# Altium project LPCB234__RLOOP__RM4_POWER_NODE.PrjPCB
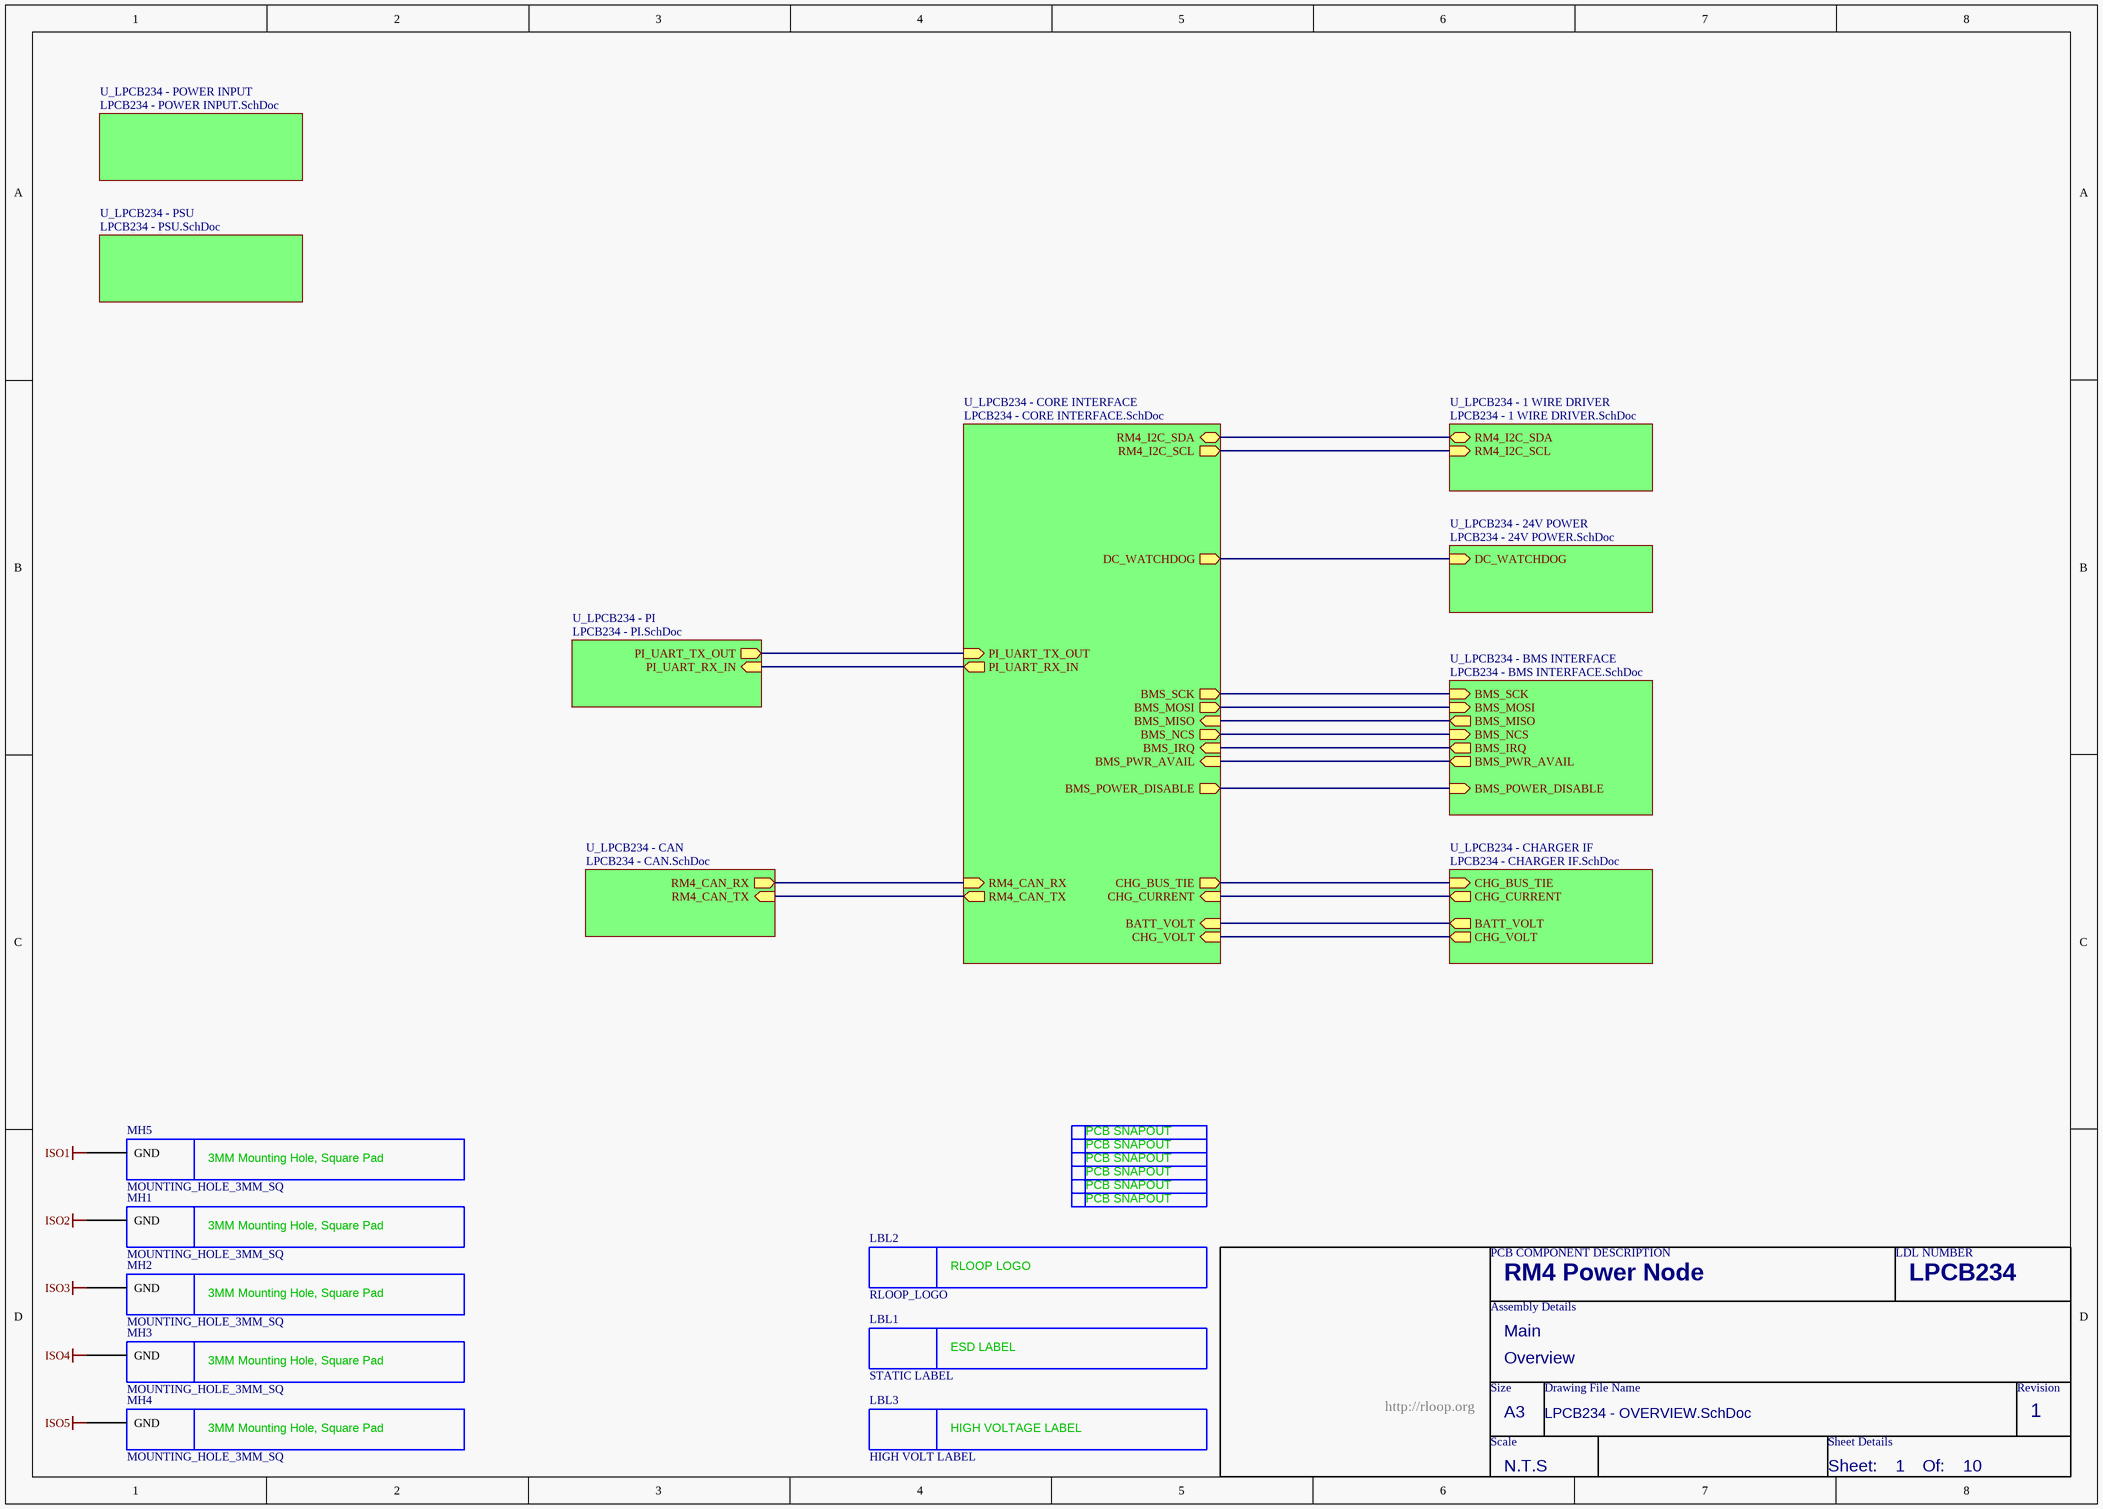
[diagram p0: LPCB234 - OVERVIEW.SchDoc]
10 sheets, 135 parts. Net scope: hierarchical (ports join the sheet entries above them; power ports are global).
Board files: LPCB234R0.PcbDoc, LPCB234R0__ASCII.PcbDoc
Sheets:
  LPCB234 - OVERVIEW.SchDoc
    U_LPCB234 - CORE INTERFACE = LPCB234 - CORE INTERFACE.SchDoc
    U_LPCB234 - 1 WIRE DRIVER = LPCB234 - 1 WIRE DRIVER.SchDoc
    U_LPCB234 - 24V POWER = LPCB234 - 24V POWER.SchDoc
    U_LPCB234 - BMS INTERFACE = LPCB234 - BMS INTERFACE.SchDoc
    U_LPCB234 - CHARGER IF = LPCB234 - CHARGER IF.SchDoc
    U_LPCB234 - POWER INPUT = LPCB234 - POWER INPUT.SchDoc
    U_LPCB234 - PSU = LPCB234 - PSU.SchDoc
    U_LPCB234 - CAN = LPCB234 - CAN.SchDoc
    U_LPCB234 - PI = LPCB234 - PI.SchDoc

## Sheet LPCB234 - OVERVIEW.SchDoc
size A3; Address1: Factory 10; Address2: 9-13 Dingley Avenue, Dandeong, VICTORIA 3175, AUSTRALIA; DocumentNumber: 1; Revision: 1; SheetNumber: 1; SheetTotal: 10; Lockie__PCB_SUB_ASSEMBLY: Overview; Lockie__PCB_ASSEMBLY: Main; Lockie__LDL: LPCB234; Lockie__PCB_DESCRIPTION: RM4 Power Node

### Parts
LBL1  STATIC LABEL  [STATIC_LABEL]  (no BOM)
LBL2  RLOOP_LOGO  [RLOOP_LOGO]  (no BOM)
LBL3  HIGH VOLT LABEL  [HIGH VOLT LABEL]  (no BOM)
MH1  MOUNTING_HOLE_3MM_SQ  [MOUNTING_HOLE_3MM_SQ]  (no BOM)
MH2  MOUNTING_HOLE_3MM_SQ  [MOUNTING_HOLE_3MM_SQ]  (no BOM)
MH3  MOUNTING_HOLE_3MM_SQ  [MOUNTING_HOLE_3MM_SQ]  (no BOM)
MH4  MOUNTING_HOLE_3MM_SQ  [MOUNTING_HOLE_3MM_SQ]  (no BOM)
MH5  MOUNTING_HOLE_3MM_SQ  [MOUNTING_HOLE_3MM_SQ]  (no BOM)
SN1  PCB_SNAPOUT  [SNAPOUT_NEW]  (value not drawn)  (no BOM)
SN2  PCB_SNAPOUT  [SNAPOUT_NEW]  (value not drawn)  (no BOM)
SN3  PCB_SNAPOUT  [SNAPOUT_NEW]  (value not drawn)  (no BOM)
SN4  PCB_SNAPOUT  [SNAPOUT_NEW]  (value not drawn)  (no BOM)
SN5  PCB_SNAPOUT  [SNAPOUT_NEW]  (value not drawn)  (no BOM)
SN6  PCB_SNAPOUT  [SNAPOUT_NEW]  (value not drawn)  (no BOM)

### Sub-sheets
U_LPCB234 - 1 WIRE DRIVER = LPCB234 - 1 WIRE DRIVER.SchDoc: RM4_I2C_SDA (bidir), RM4_I2C_SCL (in)
U_LPCB234 - 24V POWER = LPCB234 - 24V POWER.SchDoc: DC_WATCHDOG (in)
U_LPCB234 - BMS INTERFACE = LPCB234 - BMS INTERFACE.SchDoc: BMS_MOSI (in), BMS_SCK (in), BMS_MISO (out), BMS_PWR_AVAIL (out), BMS_NCS (in), BMS_IRQ (out), BMS_POWER_DISABLE (in)
U_LPCB234 - CAN = LPCB234 - CAN.SchDoc: RM4_CAN_TX (in), RM4_CAN_RX (out)
U_LPCB234 - CHARGER IF = LPCB234 - CHARGER IF.SchDoc: CHG_BUS_TIE (in), CHG_CURRENT (out), BATT_VOLT (out), CHG_VOLT (out)
U_LPCB234 - CORE INTERFACE = LPCB234 - CORE INTERFACE.SchDoc: BMS_MOSI (out), BMS_SCK (out), BMS_MISO (in), BMS_PWR_AVAIL (in), BMS_NCS (out), BMS_IRQ (in), DC_WATCHDOG (out), CHG_CURRENT (in), RM4_I2C_SDA (bidir), RM4_I2C_SCL (out), BMS_POWER_DISABLE (out), CHG_BUS_TIE (out), RM4_CAN_TX (out), RM4_CAN_RX (in), PI_UART_TX_OUT (in), PI_UART_RX_IN (out), BATT_VOLT (in), CHG_VOLT (in)
U_LPCB234 - PI = LPCB234 - PI.SchDoc: PI_UART_RX_IN (in), PI_UART_TX_OUT (out)
U_LPCB234 - POWER INPUT = LPCB234 - POWER INPUT.SchDoc: no entries
U_LPCB234 - PSU = LPCB234 - PSU.SchDoc: no entries

### Nets
ISO1: MH5.MOUNT(GND)
ISO2: MH1.MOUNT(GND)
ISO3: MH2.MOUNT(GND)
ISO4: MH3.MOUNT(GND)
ISO5: MH4.MOUNT(GND)
BMS_IRQ: sheet U_LPCB234 - CORE INTERFACE/BMS_IRQ, sheet U_LPCB234 - BMS INTERFACE/BMS_IRQ
BMS_MISO: sheet U_LPCB234 - CORE INTERFACE/BMS_MISO, sheet U_LPCB234 - BMS INTERFACE/BMS_MISO
BMS_MOSI: sheet U_LPCB234 - CORE INTERFACE/BMS_MOSI, sheet U_LPCB234 - BMS INTERFACE/BMS_MOSI
BMS_NCS: sheet U_LPCB234 - CORE INTERFACE/BMS_NCS, sheet U_LPCB234 - BMS INTERFACE/BMS_NCS
BMS_PWR_AVAIL: sheet U_LPCB234 - CORE INTERFACE/BMS_PWR_AVAIL, sheet U_LPCB234 - BMS INTERFACE/BMS_PWR_AVAIL
BMS_SCK: sheet U_LPCB234 - CORE INTERFACE/BMS_SCK, sheet U_LPCB234 - BMS INTERFACE/BMS_SCK
CHG_BUS_TIE: sheet U_LPCB234 - CORE INTERFACE/CHG_BUS_TIE, sheet U_LPCB234 - CHARGER IF/CHG_BUS_TIE
CHG_CURRENT: sheet U_LPCB234 - CORE INTERFACE/CHG_CURRENT, sheet U_LPCB234 - CHARGER IF/CHG_CURRENT
PI_UART_RX_IN: sheet U_LPCB234 - CORE INTERFACE/PI_UART_RX_IN, sheet U_LPCB234 - PI/PI_UART_RX_IN
PI_UART_TX_OUT: sheet U_LPCB234 - CORE INTERFACE/PI_UART_TX_OUT, sheet U_LPCB234 - PI/PI_UART_TX_OUT
RM4_CAN_RX: sheet U_LPCB234 - CORE INTERFACE/RM4_CAN_RX, sheet U_LPCB234 - CAN/RM4_CAN_RX
RM4_CAN_TX: sheet U_LPCB234 - CORE INTERFACE/RM4_CAN_TX, sheet U_LPCB234 - CAN/RM4_CAN_TX
RM4_I2C_SCL: sheet U_LPCB234 - CORE INTERFACE/RM4_I2C_SCL, sheet U_LPCB234 - 1 WIRE DRIVER/RM4_I2C_SCL
RM4_I2C_SDA: sheet U_LPCB234 - CORE INTERFACE/RM4_I2C_SDA, sheet U_LPCB234 - 1 WIRE DRIVER/RM4_I2C_SDA
NetCN1_2: sheet U_LPCB234 - CORE INTERFACE/DC_WATCHDOG, sheet U_LPCB234 - 24V POWER/DC_WATCHDOG
NetCN2_13: sheet U_LPCB234 - CORE INTERFACE/BMS_POWER_DISABLE, sheet U_LPCB234 - BMS INTERFACE/BMS_POWER_DISABLE
NetCN8_59: sheet U_LPCB234 - CORE INTERFACE/BATT_VOLT, sheet U_LPCB234 - CHARGER IF/BATT_VOLT
NetCN8_61: sheet U_LPCB234 - CORE INTERFACE/CHG_VOLT, sheet U_LPCB234 - CHARGER IF/CHG_VOLT

### Notes on the sheet
- PCB COMPONENT DESCRIPTION
- LDL NUMBER
- Assembly Details
- Size
- Drawing File Name
- Revision
- http://rloop.org
- Scale
- A3
- Sheet Details
- N.T.S
- Sheet:
- Of:
- (in symbol HIGH VOLT LABEL) HIGH VOLTAGE LABEL
- (in symbol MOUNTING_HOLE_3MM_SQ) 3MM Mounting Hole, Square Pad
- (in symbol PCB_SNAPOUT) PCB SNAPOUT
- (in symbol RLOOP_LOGO) RLOOP LOGO
- (in symbol STATIC LABEL) ESD LABEL

### Library data of the parts
LBL1 = STATIC LABEL: FMEDA__CHANNEL: DIAG; FMEDA__FUNCTION_IN_SYSTEM: *
LBL2 = RLOOP_LOGO: FMEDA__CHANNEL: DIAG; FMEDA__FUNCTION_IN_SYSTEM: *
LBL3 = HIGH VOLT LABEL: FMEDA__CHANNEL: DIAG; FMEDA__FUNCTION_IN_SYSTEM: *
MH1-MH5 = MOUNTING_HOLE_3MM_SQ: 3MM Mouting Hole, Square; FMEDA__CHANNEL: DIAG; FMEDA__FUNCTION_IN_SYSTEM: *
SN1-SN6 = PCB_SNAPOUT: FMEDA__CHANNEL: DIAG; FMEDA__FUNCTION_IN_SYSTEM: *

## Sheet LPCB234 - CORE INTERFACE.SchDoc
size A3; Address1: Factory 10; Address2: 9-13 Dingley Avenue, Dandeong, VICTORIA 3175, AUSTRALIA; DocumentNumber: 7; Revision: 1; SheetNumber: 7; SheetTotal: 10; Lockie__PCB_SUB_ASSEMBLY: RM48 Interface; Lockie__PCB_ASSEMBLY: Main; Lockie__LDL: LPCB234; Lockie__PCB_DESCRIPTION: RM4 Power Node
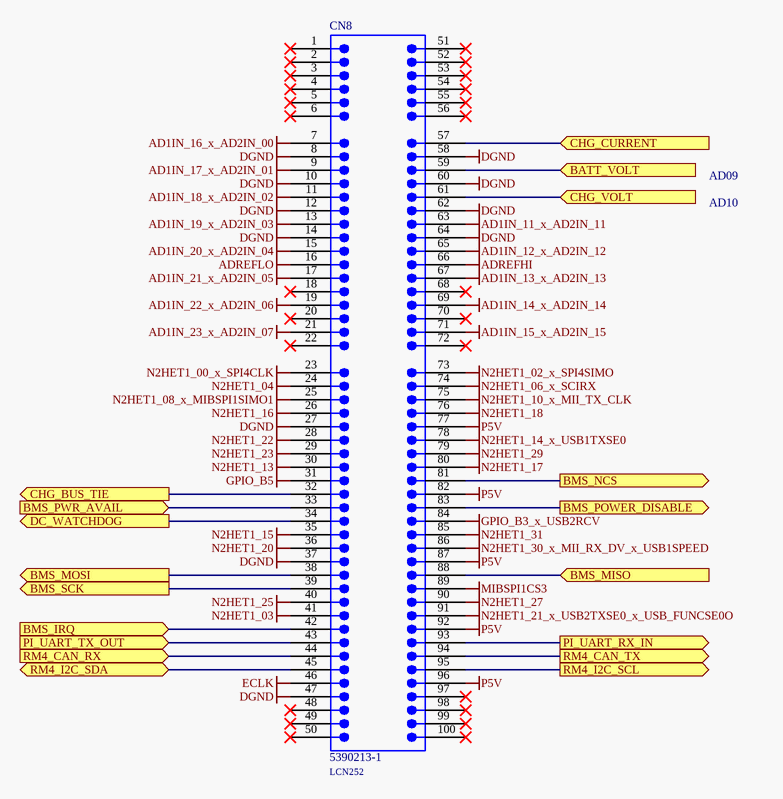
[diagram p1: LPCB234 - CORE INTERFACE.SchDoc]

### Parts
CN8  5390213-1  LDL_NUMBER: LCN252  [5390213-1]

### Ports
BATT_VOLT (in), BMS_IRQ (in), BMS_MISO (in), BMS_MOSI (out), BMS_NCS (out), BMS_POWER_DISABLE (out), BMS_PWR_AVAIL (in), BMS_SCK (out), CHG_BUS_TIE (out), CHG_CURRENT (in), CHG_VOLT (in), DC_WATCHDOG (out), PI_UART_RX_IN (out), PI_UART_TX_OUT (in), RM4_CAN_RX (in), RM4_CAN_TX (out), RM4_I2C_SCL (out), RM4_I2C_SDA (bidir)

### Nets
AD1IN_11_x_AD2IN_11: CN8.63
AD1IN_12_x_AD2IN_12: CN8.65
AD1IN_13_x_AD2IN_13: CN8.67
AD1IN_14_x_AD2IN_14: CN8.69
AD1IN_15_x_AD2IN_15: CN8.71
AD1IN_16_x_AD2IN_00: CN8.7
AD1IN_17_x_AD2IN_01: CN8.9
AD1IN_18_x_AD2IN_02: CN8.11
AD1IN_19_x_AD2IN_03: CN8.13
AD1IN_20_x_AD2IN_04: CN8.15
AD1IN_21_x_AD2IN_05: CN8.17
AD1IN_22_x_AD2IN_06: CN8.19
AD1IN_23_x_AD2IN_07: CN8.21
ADREFHI: CN8.66
ADREFLO: CN8.16
DGND: CN8.8 CN8.10 CN8.12 CN8.14 CN8.27 CN8.37 CN8.47 CN8.58 CN8.60 CN8.62 CN8.64
ECLK: CN8.46
GPIO_B3_x_USB2RCV: CN8.84
GPIO_B5: CN8.31
MIBSPI1CS3: CN8.89
N2HET1_00_x_SPI4CLK: CN8.23
N2HET1_02_x_SPI4SIMO: CN8.73
N2HET1_03: CN8.41
N2HET1_04: CN8.24
N2HET1_06_x_SCIRX: CN8.74
N2HET1_08_x_MIBSPI1SIMO1: CN8.25
N2HET1_10_x_MII_TX_CLK: CN8.75
N2HET1_13: CN8.30
N2HET1_14_x_USB1TXSE0: CN8.78
N2HET1_15: CN8.35
N2HET1_16: CN8.26
N2HET1_17: CN8.80
N2HET1_18: CN8.76
N2HET1_20: CN8.36
N2HET1_21_x_USB2TXSE0_x_USB_FUNCSE0O: CN8.91
N2HET1_22: CN8.28
N2HET1_23: CN8.29
N2HET1_25: CN8.40
N2HET1_27: CN8.90
N2HET1_29: CN8.79
N2HET1_30_x_MII_RX_DV_x_USB1SPEED: CN8.86
N2HET1_31: CN8.85
P5V: CN8.77 CN8.82 CN8.87 CN8.92 CN8.96
BMS_IRQ: CN8.42 ; port BMS_IRQ
BMS_MISO: CN8.88 ; port BMS_MISO
BMS_MOSI: CN8.38 ; port BMS_MOSI
BMS_NCS: CN8.81 ; port BMS_NCS
BMS_PWR_AVAIL: CN8.33 ; port BMS_PWR_AVAIL
BMS_SCK: CN8.39 ; port BMS_SCK
CHG_BUS_TIE: CN8.32 ; port CHG_BUS_TIE
CHG_CURRENT: CN8.57 ; port CHG_CURRENT
PI_UART_RX_IN: CN8.93 ; port PI_UART_RX_IN
PI_UART_TX_OUT: CN8.43 ; port PI_UART_TX_OUT
RM4_CAN_RX: CN8.44 ; port RM4_CAN_RX
RM4_CAN_TX: CN8.94 ; port RM4_CAN_TX
RM4_I2C_SCL: CN8.95 ; port RM4_I2C_SCL
RM4_I2C_SDA: CN8.45 ; port RM4_I2C_SDA
NetCN1_2: CN8.34 ; port DC_WATCHDOG
NetCN2_13: CN8.83 ; port BMS_POWER_DISABLE
NetCN8_59: CN8.59 ; port BATT_VOLT
NetCN8_61: CN8.61 ; port CHG_VOLT

Not connected (* = marked no-connect by the designer): CN8 1* 2* 3* 4* 5* 6* 18* 20* 22* 48* 49* 50* 51* 52* 53* 54* 55* 56* 68* 70* 72* 97* 98* 99* 100*

### Notes on the sheet
- AD09
- AD10
- PCB COMPONENT DESCRIPTION
- LDL NUMBER
- Assembly Details
- Size
- Drawing File Name
- Revision
- http://rloop.org
- Scale
- A3
- Sheet Details
- N.T.S
- Sheet:
- Of:

### Library data of the parts
CN8 = 5390213-1: Connector, DIMM 100; FMEDA__FUNCTION_IN_SYSTEM: *

## Sheet LPCB234 - 1 WIRE DRIVER.SchDoc
size A3; Address1: Factory 10; Address2: 9-13 Dingley Avenue, Dandeong, VICTORIA 3175, AUSTRALIA; DocumentNumber: 2; Revision: 1; SheetNumber: 2; SheetTotal: 10; Lockie__PCB_SUB_ASSEMBLY: 1 Wire; Lockie__PCB_ASSEMBLY: Main; Lockie__LDL: LPCB234; Lockie__PCB_DESCRIPTION: RM4 Power Node
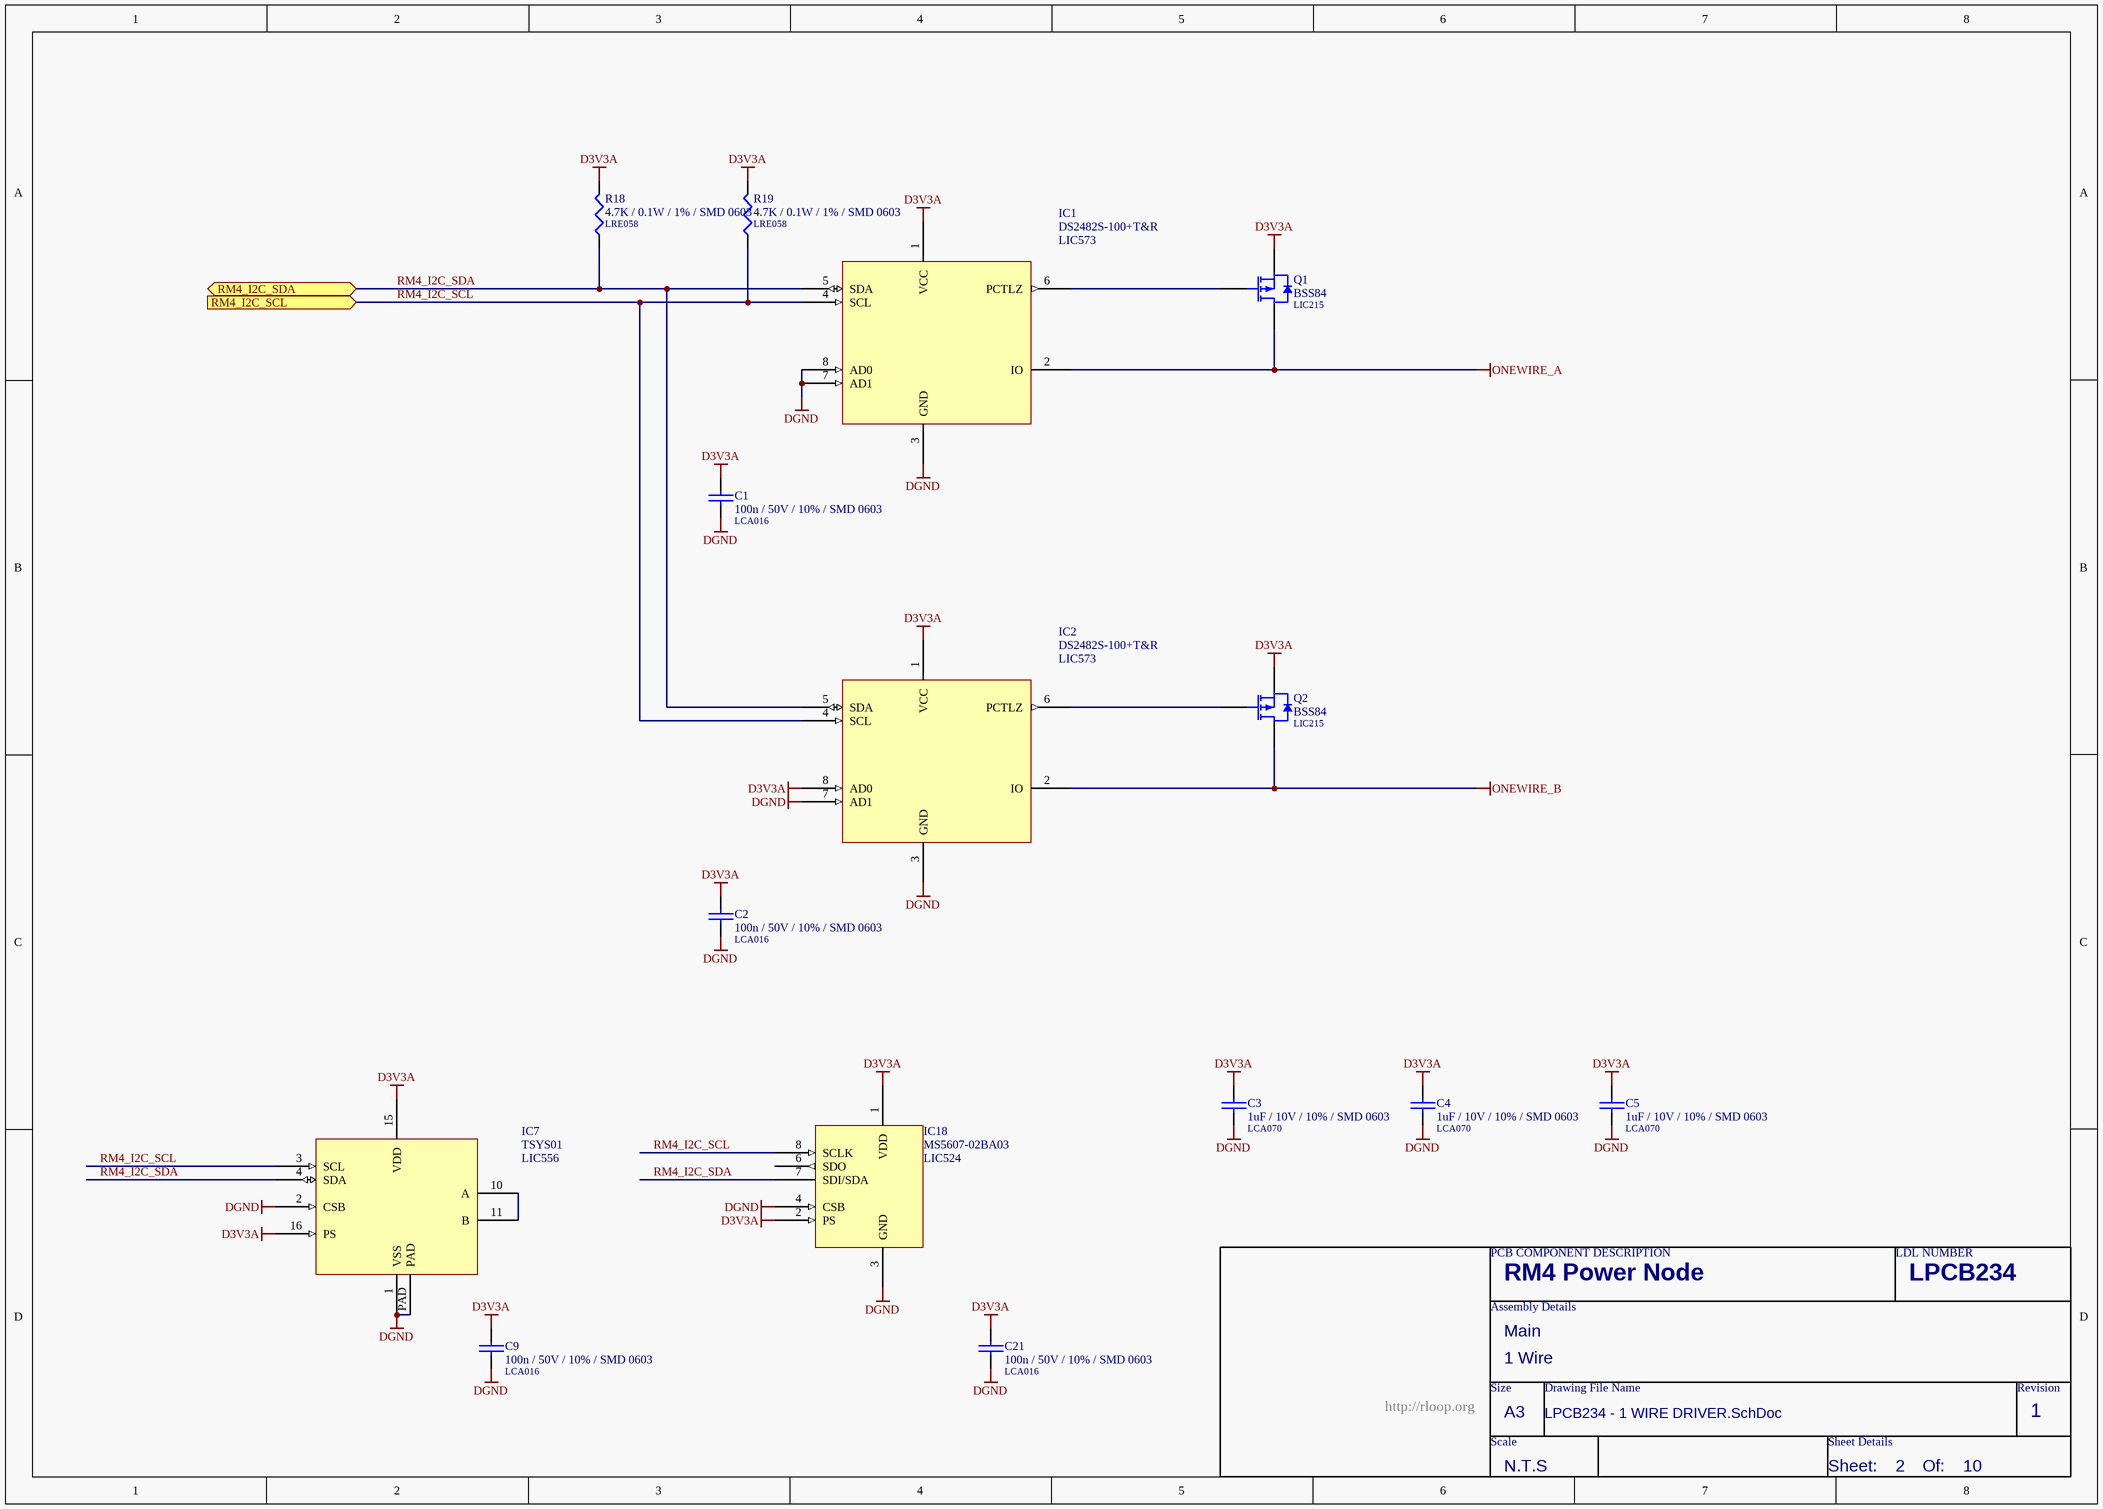
[diagram p2: LPCB234 - 1 WIRE DRIVER.SchDoc]

### Parts
C1  100n / 50V / 10% / SMD 0603  LDL_NUMBER: LCA016  [LFP011__CC1608-0603-IPC7351_B]
C2  100n / 50V / 10% / SMD 0603  LDL_NUMBER: LCA016  [LFP011__CC1608-0603-IPC7351_B]
C3  1uF / 10V / 10% / SMD 0603  LDL_NUMBER: LCA070  [LFP011__CC1608-0603-IPC7351_B]
C4  1uF / 10V / 10% / SMD 0603  LDL_NUMBER: LCA070  [LFP011__CC1608-0603-IPC7351_B]
C5  1uF / 10V / 10% / SMD 0603  LDL_NUMBER: LCA070  [LFP011__CC1608-0603-IPC7351_B]
C9  100n / 50V / 10% / SMD 0603  LDL_NUMBER: LCA016  [LFP011__CC1608-0603-IPC7351_B]
C21  100n / 50V / 10% / SMD 0603  LDL_NUMBER: LCA016  [LFP011__CC1608-0603-IPC7351_B]
IC1  DS2482S-100+T&R  LDL_NUMBER: LIC573  [LFP069__R-8G]
IC2  DS2482S-100+T&R  LDL_NUMBER: LIC573  [LFP069__R-8G]
IC7  TSYS01  LDL_NUMBER: LIC556  [LFP135__QFN65P400X400X80_HS-17M]
IC18  MS5607-02BA03  LDL_NUMBER: LIC524  [LFP140__QFN8]
Q1  BSS84  LDL_NUMBER: LIC215  [LFP021__SOT23]
Q2  BSS84  LDL_NUMBER: LIC215  [LFP021__SOT23]
R18  4.7K / 0.1W / 1% / SMD 0603  LDL_NUMBER: LRE058  [LFP020__CR1608-0603-IPC7351_B]
R19  4.7K / 0.1W / 1% / SMD 0603  LDL_NUMBER: LRE058  [LFP020__CR1608-0603-IPC7351_B]

### Ports
RM4_I2C_SCL (in), RM4_I2C_SDA (bidir)

### Nets
D3V3A: C1.1 C2.1 C3.1 C4.1 C5.1 C9.1 C21.1 IC1.1(VCC) IC2.1(VCC) IC2.8(AD0) IC7.15(VDD) IC7.16(PS) IC18.1(VDD) IC18.2(PS) Q1.2(S) Q2.2(S) R18.2 R19.2
DGND: C1.2 C2.2 C3.2 C4.2 C5.2 C9.2 C21.2 IC1.3(GND) IC1.7(AD1) IC1.8(AD0) IC2.3(GND) IC2.7(AD1) IC7.1(VSS) IC7.2(CSB) IC7.PAD IC18.3(GND) IC18.4(CSB)
ONEWIRE_A: IC1.2(IO) Q1.3(D)
ONEWIRE_B: IC2.2(IO) Q2.3(D)
RM4_I2C_SCL: IC1.4(SCL) IC2.4(SCL) IC7.3(SCL) IC18.8(SCLK) R19.1 ; port RM4_I2C_SCL
RM4_I2C_SDA: IC1.5(SDA) IC2.5(SDA) IC7.4(SDA) IC18.7(SDI/SDA) R18.1 ; port RM4_I2C_SDA
NetIC1_6: IC1.6(PCTLZ) Q1.1(G)
NetIC2_6: IC2.6(PCTLZ) Q2.1(G)
NetIC7_10: IC7.10(A) IC7.11(B)

Not connected (* = marked no-connect by the designer): IC18 6(SDO)

### Notes on the sheet
- PCB COMPONENT DESCRIPTION
- LDL NUMBER
- Assembly Details
- Size
- Drawing File Name
- Revision
- http://rloop.org
- Scale
- A3
- Sheet Details
- N.T.S
- Sheet:
- Of:

### Library data of the parts
C1 C2 C9 C21 = 100n / 50V / 10% / SMD 0603: Capacitor, Ceramic Chip, 100nF (0.1uF), 50V, 5%, SMD 0603 [LCA016]; FMEDA__OPERATING__VOLTAGE_MIN: 0; FMEDA__OPERATING__VOLTAGE_MAX: 3.3; FMEDA__OPERATING__TEMP_MIN: -20; FMEDA__OPERATING__TEMP_TYP: 27; FMEDA__OPERATING__TEMP_MAX: 50; FMEDA__CHANNEL: COM; Value: 100n; FMEDA__FUNCTION_IN_SYSTEM: *; FMEDA__OPERATING__VOLTAGE_TYP: 3.3
C3-C5 = 1uF / 10V / 10% / SMD 0603: Capacitor, Ceramic Chip, 1uF, 10V, SMD 0603 [LCA070]; Value: 1u; FMEDA__OPERATING__VOLTAGE_MAX: 3.3; FMEDA__OPERATING__VOLTAGE_MIN: 0; FMEDA__OPERATING__TEMP_MAX: 50; FMEDA__OPERATING__TEMP_MIN: -20; FMEDA__OPERATING__TEMP_TYP: 27; FMEDA__CHANNEL: COM; FMEDA__OPERATING__VOLTAGE_TYP: 3.3; FMEDA__FUNCTION_IN_SYSTEM: *
IC1 IC2 = DS2482S-100+T&R: IC, I2C to 1 Wire Bridge, SMD SOIC8
IC7 = TSYS01: IC, Digital Temp Sensor, SMD QFN16 [LIC556]
IC18 = MS5607-02BA03: IC, Pressure Sensor IC, SMD QFN8 [LIC524]
Q1 Q2 = BSS84: FET, P Channel, Logic Level, SMD SOT23 [LIC215]; FMEDA__OPERATING__TEMP_MAX: 50; FMEDA__OPERATING__TEMP_MIN: -20; FMEDA__OPERATING__TEMP_TYP: 27; FMEDA__CHANNEL: COM
R18 R19 = 4.7K / 0.1W / 1% / SMD 0603: Resistor, Ceramic Chip, 4K7, 0.1W, 1%, SMD 0603 [LRE058]; FMEDA__OPERATING__POWER_MAX: 0; FMEDA__OPERATING__TEMP_MAX: 50; FMEDA__OPERATING__TEMP_MIN: -20; FMEDA__OPERATING__TEMP_TYP: 27; FMEDA__CHANNEL: COM; VALUE: 4.7K; FMEDA__OPERATING__POWER_MIN: 0; FMEDA__OPERATING__VOLTAGE_MAX: 0; FMEDA__OPERATING__VOLTAGE_MIN: 0; FMEDA__OPERATING__VOLTAGE_TYP: 0; FMEDA__FUNCTION_IN_SYSTEM: *

## Sheet LPCB234 - 24V POWER.SchDoc
size A3; Address1: Factory 10; Address2: 9-13 Dingley Avenue, Dandeong, VICTORIA 3175, AUSTRALIA; DocumentNumber: 3; Revision: 1; SheetNumber: 3; SheetTotal: 10; Lockie__PCB_SUB_ASSEMBLY: 24V Switch; Lockie__PCB_ASSEMBLY: Main; Lockie__LDL: LPCB234; Lockie__PCB_DESCRIPTION: RM4 Power Node
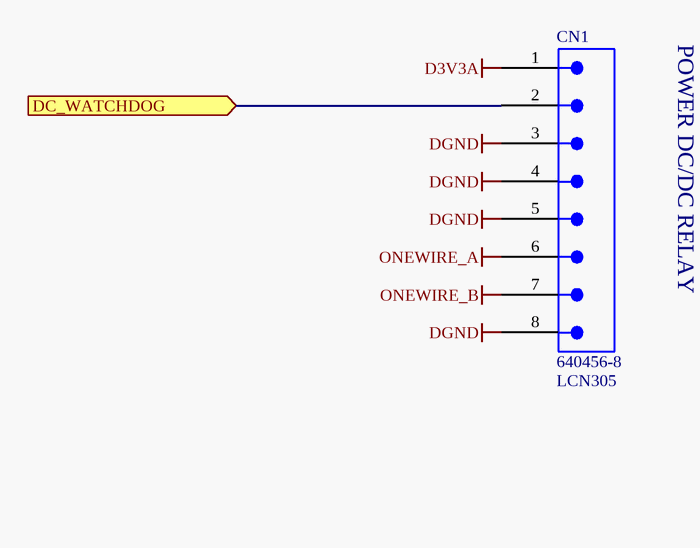
[diagram p3: LPCB234 - 24V POWER.SchDoc]

### Parts
CN1  640456-8  LDL_NUMBER: LCN305  [640456-8]

### Ports
DC_WATCHDOG (in)

### Nets
D3V3A: CN1.1
DGND: CN1.3 CN1.4 CN1.5 CN1.8
ONEWIRE_A: CN1.6
ONEWIRE_B: CN1.7
NetCN1_2: CN1.2 ; port DC_WATCHDOG

### Notes on the sheet
- POWER DC/DC RELAY
- PCB COMPONENT DESCRIPTION
- LDL NUMBER
- Assembly Details
- Size
- Drawing File Name
- Revision
- http://rloop.org
- Scale
- A3
- Sheet Details
- N.T.S
- Sheet:
- Of:

### Library data of the parts
CN1 = 640456-8: Connector, Male Header, 8 Way; FMEDA__CHANNEL: COM; FMEDA__OPERATING__CURRENT_MAX: 0; FMEDA__OPERATING__TEMP_MAX: 50; FMEDA__OPERATING__TEMP_MIN: -20; FMEDA__OPERATING__TEMP_TYP: 27; FMEDA__OPERATING__VOLTAGE_MAX: 16; FMEDA__OPERATING__VOLTAGE_TYP: 12; FMEDA__FUNCTION_IN_SYSTEM: *; FMEDA__OPERATING__CURRENT_MIN: 0; FMEDA__OPERATING__CURRENT_TYP: 0; FMEDA__OPERATING__VOLTAGE_MIN: 0

## Sheet LPCB234 - BMS INTERFACE.SchDoc
size A3; Address1: Factory 10; Address2: 9-13 Dingley Avenue, Dandeong, VICTORIA 3175, AUSTRALIA; DocumentNumber: 4; Revision: 1; SheetNumber: 4; SheetTotal: 10; Lockie__PCB_SUB_ASSEMBLY: BMS Interface; Lockie__PCB_ASSEMBLY: Main; Lockie__LDL: LPCB234; Lockie__PCB_DESCRIPTION: RM4 Power Node
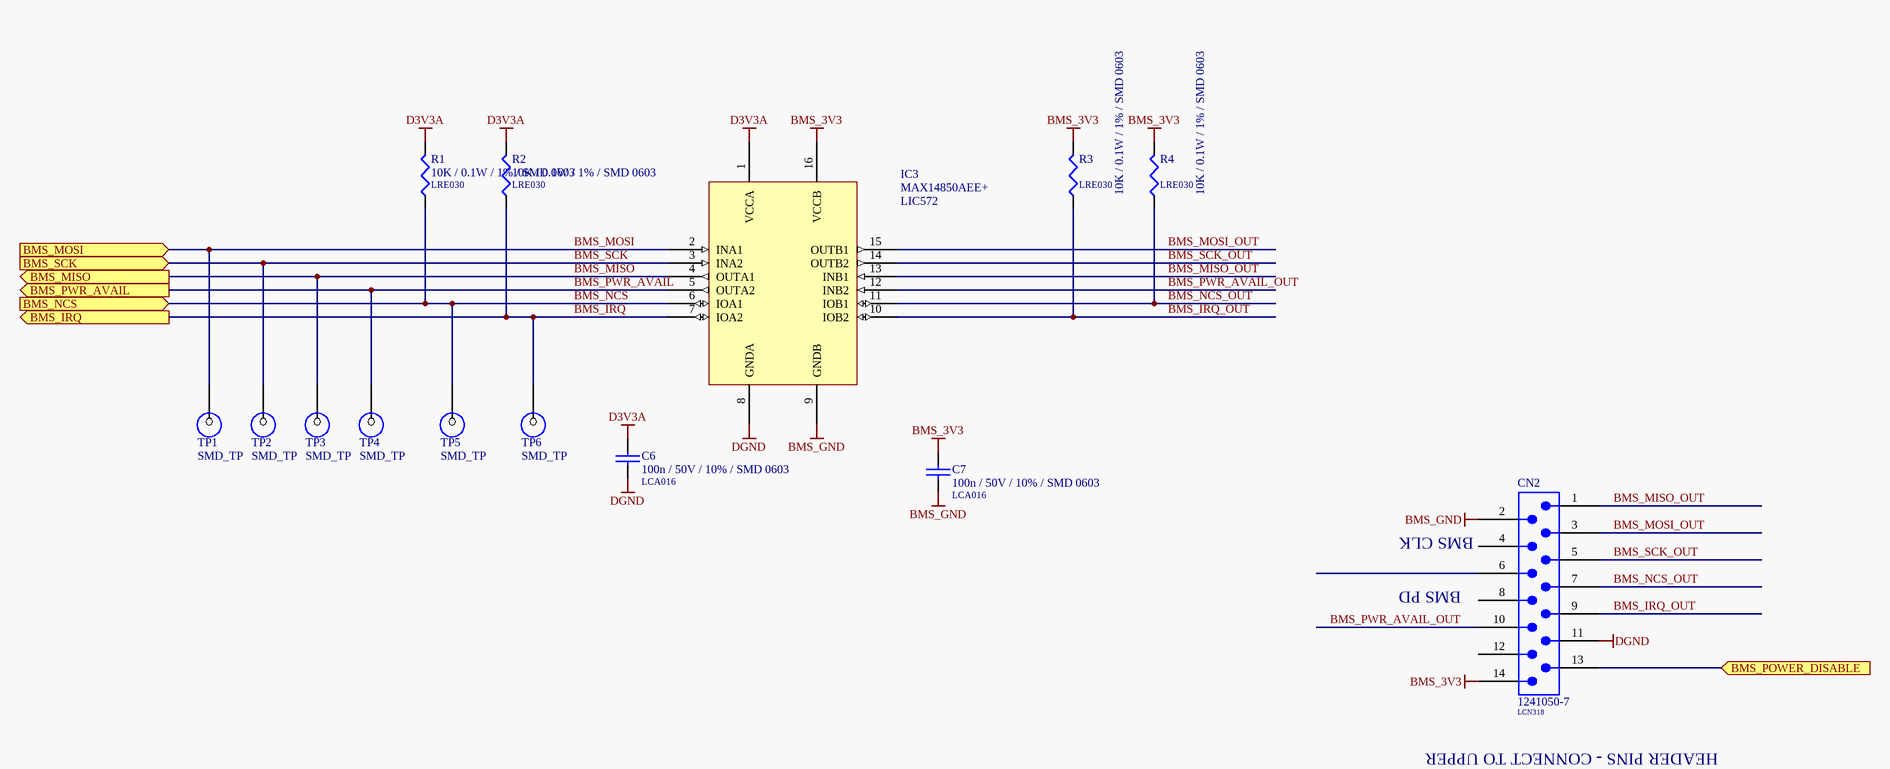
[diagram p4: LPCB234 - BMS INTERFACE.SchDoc]

### Parts
C6  100n / 50V / 10% / SMD 0603  LDL_NUMBER: LCA016  [LFP011__CC1608-0603-IPC7351_B]
C7  100n / 50V / 10% / SMD 0603  LDL_NUMBER: LCA016  [LFP011__CC1608-0603-IPC7351_B]
CN2  1241050-7  LDL_NUMBER: LCN318  [1241050-7]
IC3  MAX14850AEE+  LDL_NUMBER: LIC572  [LFP137__PW016]
R1  10K / 0.1W / 1% / SMD 0603  LDL_NUMBER: LRE030  [LFP020__CR1608-0603-IPC7351_B]
R2  10K / 0.1W / 1% / SMD 0603  LDL_NUMBER: LRE030  [LFP020__CR1608-0603-IPC7351_B]
R3  10K / 0.1W / 1% / SMD 0603  LDL_NUMBER: LRE030  [LFP020__CR1608-0603-IPC7351_B]
R4  10K / 0.1W / 1% / SMD 0603  LDL_NUMBER: LRE030  [LFP020__CR1608-0603-IPC7351_B]
TP1  SMD_TP  [SMD-TP]  (no BOM)
TP2  SMD_TP  [SMD-TP]  (no BOM)
TP3  SMD_TP  [SMD-TP]  (no BOM)
TP4  SMD_TP  [SMD-TP]  (no BOM)
TP5  SMD_TP  [SMD-TP]  (no BOM)
TP6  SMD_TP  [SMD-TP]  (no BOM)

### Ports
BMS_IRQ (out), BMS_MISO (out), BMS_MOSI (in), BMS_NCS (in), BMS_POWER_DISABLE (in), BMS_PWR_AVAIL (out), BMS_SCK (in)

### Nets
BMS_3V3: C7.1 CN2.14 IC3.16(VCCB) R3.2 R4.2
BMS_GND: C7.2 CN2.2 IC3.9(GNDB)
D3V3A: C6.1 IC3.1(VCCA) R1.2 R2.2
DGND: C6.2 CN2.11 IC3.8(GNDA)
BMS_IRQ: IC3.7(IOA2) R2.1 TP6.1 ; port BMS_IRQ
BMS_IRQ_OUT: CN2.9 IC3.10(IOB2) R3.1
BMS_MISO: IC3.4(OUTA1) TP3.1 ; port BMS_MISO
BMS_MISO_OUT: CN2.1 IC3.13(INB1)
BMS_MOSI: IC3.2(INA1) TP1.1 ; port BMS_MOSI
BMS_MOSI_OUT: CN2.3 IC3.15(OUTB1)
BMS_NCS: IC3.6(IOA1) R1.1 TP5.1 ; port BMS_NCS
BMS_NCS_OUT: CN2.7 IC3.11(IOB1) R4.1
BMS_PWR_AVAIL: IC3.5(OUTA2) TP4.1 ; port BMS_PWR_AVAIL
BMS_PWR_AVAIL_OUT: CN2.10 IC3.12(INB2)
BMS_SCK: IC3.3(INA2) TP2.1 ; port BMS_SCK
BMS_SCK_OUT: CN2.5 IC3.14(OUTB2)
NetCN2_13: CN2.13 ; port BMS_POWER_DISABLE

Not connected (* = marked no-connect by the designer): CN2 4 6 8 12

### Notes on the sheet
- BMS CLK
- BMS PD
- HEADER PINS - CONNECT TO UPPER
- PCB COMPONENT DESCRIPTION
- LDL NUMBER
- Assembly Details
- Size
- Drawing File Name
- Revision
- http://rloop.org
- Scale
- A3
- Sheet Details
- N.T.S
- Sheet:
- Of:

### Library data of the parts
C6 C7 = 100n / 50V / 10% / SMD 0603: as C1 on sheet LPCB234 - 1 WIRE DRIVER; Value: 100n; FMEDA__FUNCTION_IN_SYSTEM: *; FMEDA__OPERATING__VOLTAGE_TYP: 3.3
CN2 = 1241050-7: Connector, Header, 2.54mm, 7 Pins x 2 Rows, SMD; FMEDA__CHANNEL: COM; FMEDA__OPERATING__CURRENT_MAX: 0; FMEDA__OPERATING__TEMP_MAX: 50; FMEDA__OPERATING__TEMP_MIN: -20; FMEDA__OPERATING__TEMP_TYP: 27; FMEDA__OPERATING__VOLTAGE_MAX: 16; FMEDA__OPERATING__VOLTAGE_TYP: 12; FMEDA__FUNCTION_IN_SYSTEM: *; FMEDA__OPERATING__CURRENT_MIN: 0; FMEDA__OPERATING__CURRENT_TYP: 0; FMEDA__OPERATING__VOLTAGE_MIN: 0
IC3 = MAX14850AEE+: IC, 6 Channel Digital Isolator, SMD [LIC572]
R1-R4 = 10K / 0.1W / 1% / SMD 0603: Resistor, Ceramic Chip, 10K, 0.1W, 1%, SMD 0603 [LRE030]; FMEDA__OPERATING__POWER_MAX: 0; FMEDA__OPERATING__TEMP_MAX: 50; FMEDA__OPERATING__TEMP_MIN: -20; FMEDA__OPERATING__TEMP_TYP: 27; FMEDA__CHANNEL: COM; Value: 10K; FMEDA__OPERATING__POWER_MIN: 0; FMEDA__OPERATING__VOLTAGE_MAX: 0; FMEDA__OPERATING__VOLTAGE_MIN: 0; FMEDA__OPERATING__VOLTAGE_TYP: 0; FMEDA__FUNCTION_IN_SYSTEM: *
TP1-TP6 = SMD_TP: SMD Test Point; FMEDA__CHANNEL: COM; FMEDA__OPERATING__CURRENT_MAX: 0; FMEDA__OPERATING__TEMP_MAX: 50; FMEDA__OPERATING__TEMP_MIN: -20; FMEDA__OPERATING__TEMP_TYP: 27; FMEDA__OPERATING__VOLTAGE_MAX: 16; FMEDA__OPERATING__VOLTAGE_TYP: 12; FMEDA__OPERATING__CURRENT_MIN: 0; FMEDA__OPERATING__CURRENT_TYP: 0; FMEDA__OPERATING__VOLTAGE_MIN: 0

## Sheet LPCB234 - CHARGER IF.SchDoc
size A3; Address1: Factory 10; Address2: 9-13 Dingley Avenue, Dandeong, VICTORIA 3175, AUSTRALIA; DocumentNumber: 6; Revision: 1; SheetNumber: 6; SheetTotal: 10; Lockie__PCB_SUB_ASSEMBLY: Charger Interface; Lockie__PCB_ASSEMBLY: Main; Lockie__LDL: LPCB234; Lockie__PCB_DESCRIPTION: RM4 Power Node
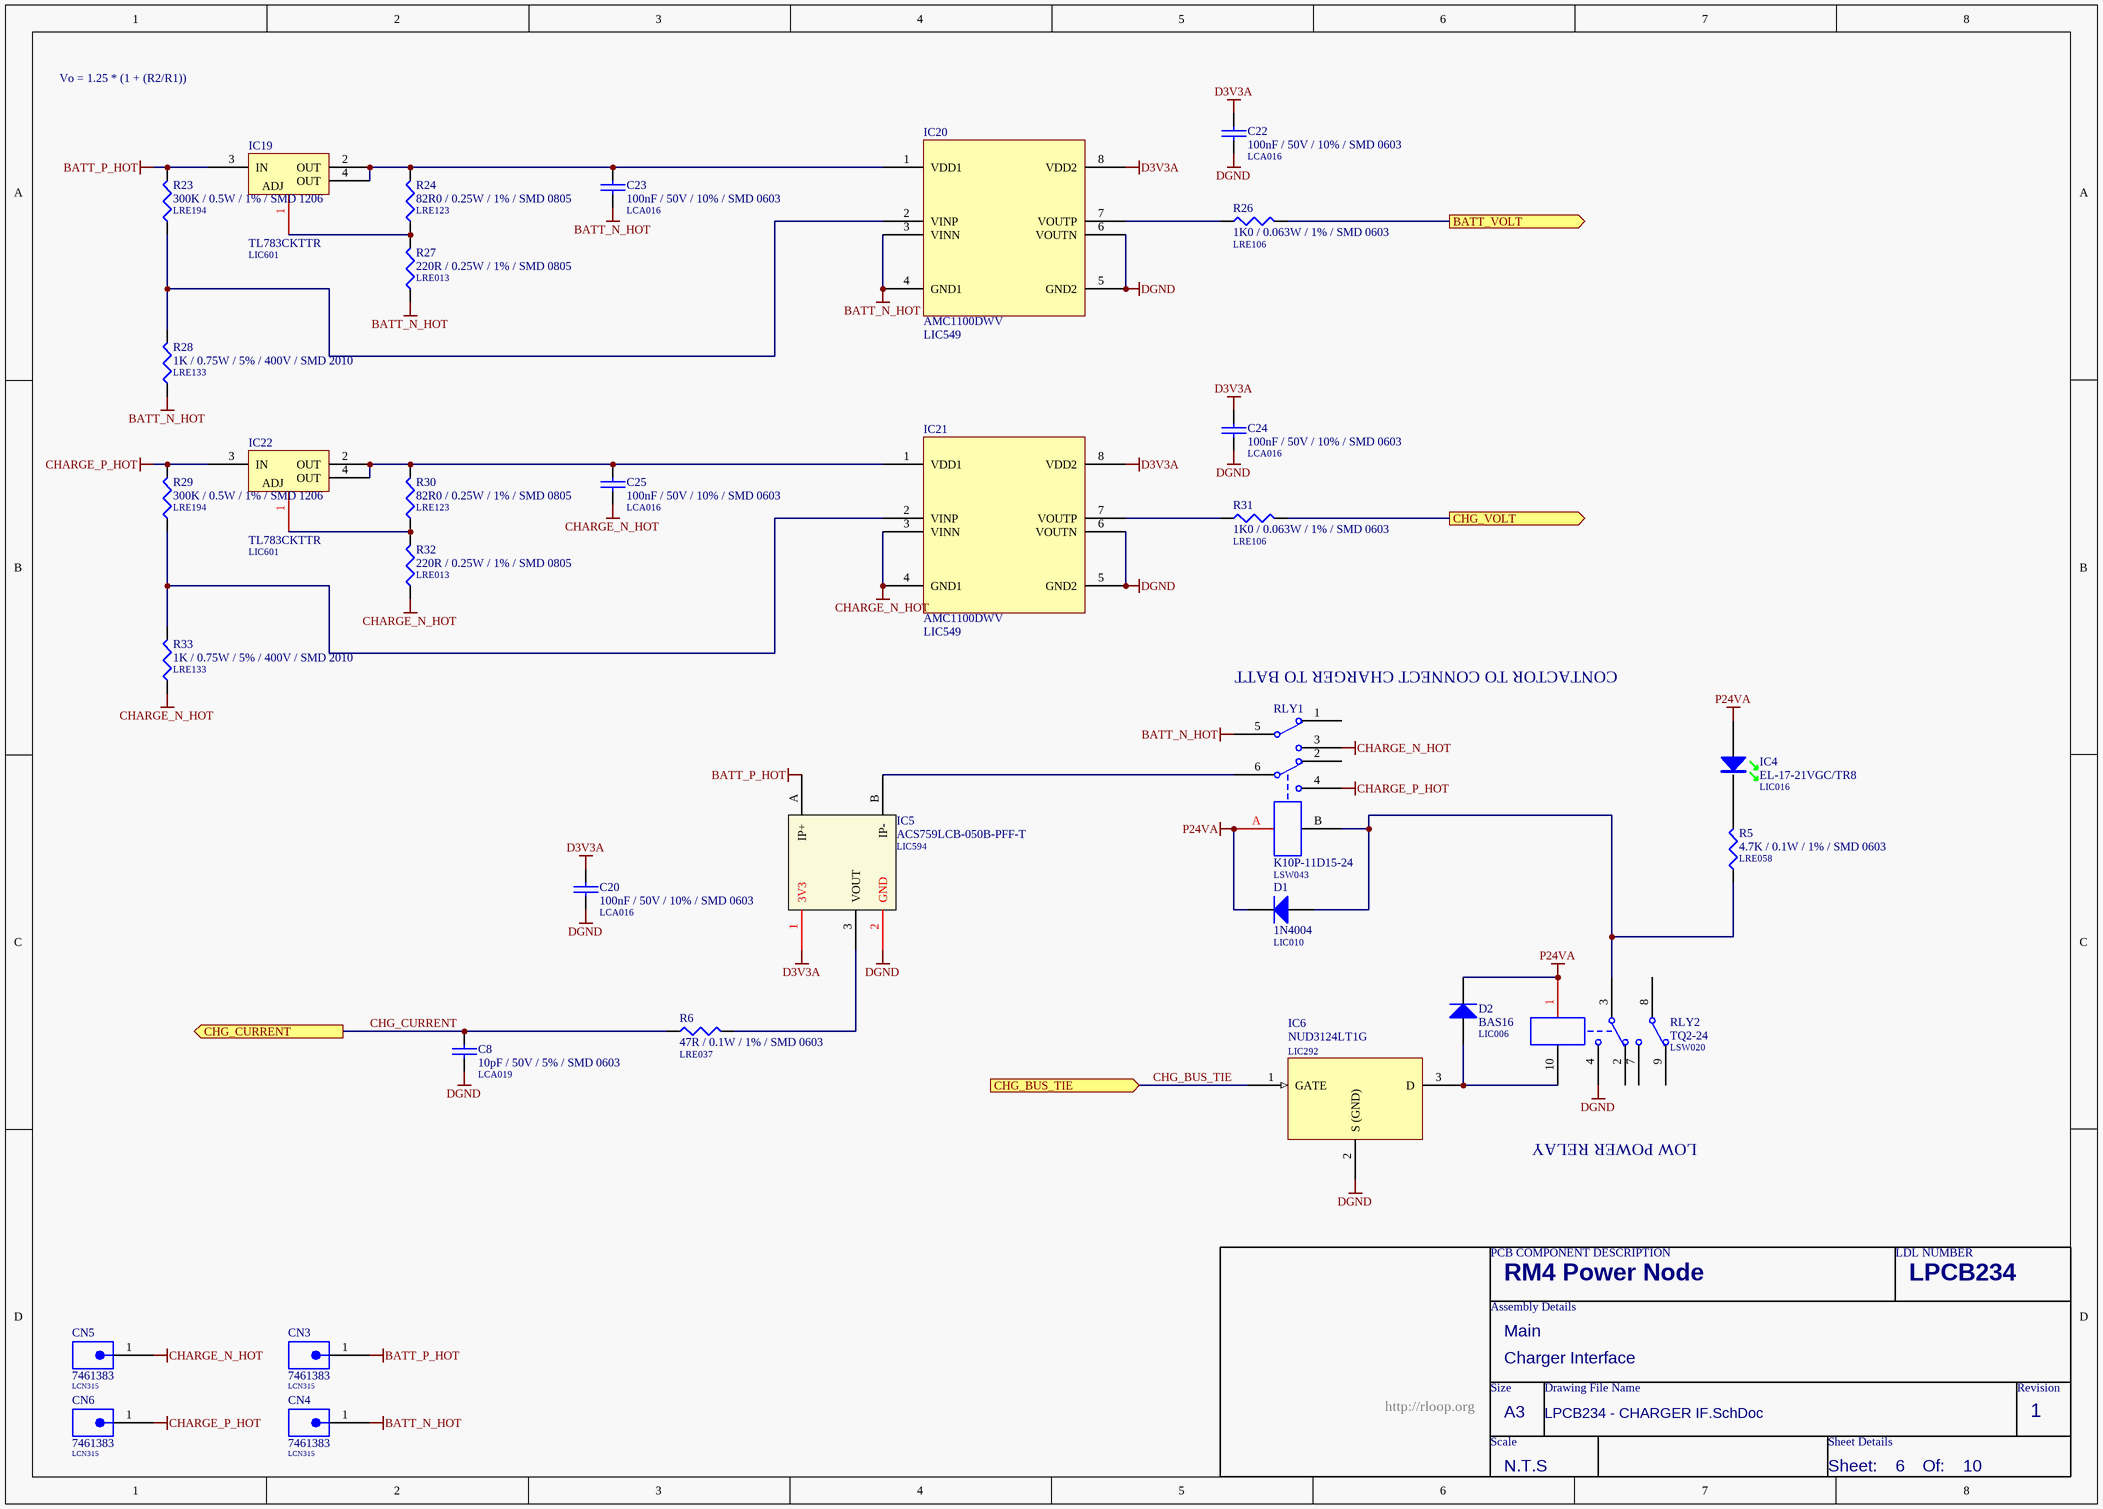
[diagram p5: LPCB234 - CHARGER IF.SchDoc]

### Parts
C8  10pF / 50V / 5% / SMD 0603  LDL_NUMBER: LCA019  [LFP011__CC1608-0603-IPC7351_B]
C20  100nF / 50V / 10% / SMD 0603  LDL_NUMBER: LCA016  [LFP011__CC1608-0603-IPC7351_B]
C22  100nF / 50V / 10% / SMD 0603  LDL_NUMBER: LCA016  [LFP011__CC1608-0603-IPC7351_B]
C23  100nF / 50V / 10% / SMD 0603  LDL_NUMBER: LCA016  [LFP011__CC1608-0603-IPC7351_B]
C24  100nF / 50V / 10% / SMD 0603  LDL_NUMBER: LCA016  [LFP011__CC1608-0603-IPC7351_B]
C25  100nF / 50V / 10% / SMD 0603  LDL_NUMBER: LCA016  [LFP011__CC1608-0603-IPC7351_B]
CN3  7461383  LDL_NUMBER: LCN315  [7461383]
CN4  7461383  LDL_NUMBER: LCN315  [7461383]
CN5  7461383  LDL_NUMBER: LCN315  [7461383]
CN6  7461383  LDL_NUMBER: LCN315  [7461383]
D1  1N4004  LDL_NUMBER: LIC010  [DO-41]
D2  BAS16  LDL_NUMBER: LIC006  [LFP021__SOT23]
IC4  EL-17-21VGC/TR8  LDL_NUMBER: LIC016  [CR2012-0805-LED]
IC5  ACS759LCB-050B-PFF-T  LDL_NUMBER: LIC594  [CB-PFF]
IC6  NUD3124LT1G  LDL_NUMBER: LIC292  [LFP021__SOT23]
IC19  TL783CKTTR  LDL_NUMBER: LIC601  [LFP147__KTT-R-PSFM-G3]
IC20  AMC1100DWV  LDL_NUMBER: LIC549  [LFP116__R-PDSO-G8]
IC21  AMC1100DWV  LDL_NUMBER: LIC549  [LFP116__R-PDSO-G8]
IC22  TL783CKTTR  LDL_NUMBER: LIC601  [LFP147__KTT-R-PSFM-G3]
R5  4.7K / 0.1W / 1% / SMD 0603  LDL_NUMBER: LRE058  [LFP020__CR1608-0603-IPC7351_B]
R6  47R / 0.1W / 1% / SMD 0603  LDL_NUMBER: LRE037  [LFP020__CR1608-0603-IPC7351_B]
R23  300K / 0.5W / 1% / SMD 1206  LDL_NUMBER: LRE194  [LFP107__CR3216-1206]
R24  82R0 / 0.25W / 1% / SMD 0805  LDL_NUMBER: LRE123  [LFP029__CR2012-0805]
R26  1K0 / 0.063W / 1% / SMD 0603  LDL_NUMBER: LRE106  [LFP020__CR1608-0603-IPC7351_B]
R27  220R / 0.25W / 1% / SMD 0805  LDL_NUMBER: LRE013  [LFP029__CR2012-0805]
R28  1K / 0.75W / 5% / 400V / SMD 2010  LDL_NUMBER: LRE133  [LFP060__CR5025-2010]
R29  300K / 0.5W / 1% / SMD 1206  LDL_NUMBER: LRE194  [LFP107__CR3216-1206]
R30  82R0 / 0.25W / 1% / SMD 0805  LDL_NUMBER: LRE123  [LFP029__CR2012-0805]
R31  1K0 / 0.063W / 1% / SMD 0603  LDL_NUMBER: LRE106  [LFP020__CR1608-0603-IPC7351_B]
R32  220R / 0.25W / 1% / SMD 0805  LDL_NUMBER: LRE013  [LFP029__CR2012-0805]
R33  1K / 0.75W / 5% / 400V / SMD 2010  LDL_NUMBER: LRE133  [LFP060__CR5025-2010]
RLY1  K10P-11D15-24  LDL_NUMBER: LSW043  [K10P-11D15-24]
RLY2  TQ2-24  LDL_NUMBER: LSW020  [TQ2]

### Ports
BATT_VOLT (out), CHG_BUS_TIE (in), CHG_CURRENT (out), CHG_VOLT (out)

### Nets
BATT_N_HOT: C23.2 CN4.1 IC20.3(VINN) IC20.4(GND1) R27.1 R28.1 RLY1.5
BATT_P_HOT: CN3.1 IC5.A(IP+) IC19.3(IN) R23.2
CHARGE_N_HOT: C25.2 CN5.1 IC21.3(VINN) IC21.4(GND1) R32.1 R33.1 RLY1.3
CHARGE_P_HOT: CN6.1 IC22.3(IN) R29.2 RLY1.4
D3V3A: C20.1 C22.1 C24.1 IC5.1(3V3) IC20.8(VDD2) IC21.8(VDD2)
DGND: C8.2 C20.2 C22.2 C24.2 IC5.2(GND) IC6.2(S_(GND)) IC20.5(GND2) IC20.6(VOUTN) IC21.5(GND2) IC21.6(VOUTN) RLY2.4
P24VA: D1.K D2.3(K) IC4.A RLY1.A RLY2.1
CHG_BUS_TIE: IC6.1(GATE) ; port CHG_BUS_TIE
CHG_CURRENT: C8.1 R6.1 ; port CHG_CURRENT
NetC23_1: C23.1 IC19.2(OUT) IC19.4(OUT) IC20.1(VDD1) R24.2
NetC25_1: C25.1 IC21.1(VDD1) IC22.2(OUT) IC22.4(OUT) R30.2
NetCN8_59: R26.2 ; port BATT_VOLT
NetCN8_61: R31.2 ; port CHG_VOLT
NetD1_A: D1.A R5.1 RLY1.B RLY2.3
NetD2_1: D2.1(A) IC6.3(D) RLY2.10
NetIC4_K: IC4.K R5.2
NetIC5_3: IC5.3(VOUT) R6.2
NetIC5_B: IC5.B(IP-) RLY1.6
NetIC19_1: IC19.1(ADJ) R24.1 R27.2
NetIC20_2: IC20.2(VINP) R23.1 R28.2
NetIC20_7: IC20.7(VOUTP) R26.1
NetIC21_2: IC21.2(VINP) R29.1 R33.2
NetIC21_7: IC21.7(VOUTP) R31.1
NetIC22_1: IC22.1(ADJ) R30.1 R32.2

Not connected (* = marked no-connect by the designer): RLY1 1 2; RLY2 2 7 8 9

### Notes on the sheet
- Vo = 1.25 * (1 + (R2/R1))
- (near RLY1) CONTACTOR TO CONNECT CHARGER TO BATT
- LOW POWER RELAY
- PCB COMPONENT DESCRIPTION
- LDL NUMBER
- Assembly Details
- Size
- Drawing File Name
- Revision
- http://rloop.org
- Scale
- A3
- Sheet Details
- N.T.S
- Sheet:
- Of:

### Library data of the parts
C8 = 10pF / 50V / 5% / SMD 0603: Capacitor, Ceramic Chip, 10pF, 50V, 5%, SMD 0603 [LCA019]; Value: 10p; FMEDA__OPERATING__VOLTAGE_MAX: 3.3; FMEDA__OPERATING__VOLTAGE_MIN: 0; FMEDA__OPERATING__TEMP_MAX: 50; FMEDA__OPERATING__TEMP_MIN: -20; FMEDA__OPERATING__TEMP_TYP: 27; FMEDA__CHANNEL: COM; FMEDA__OPERATING__VOLTAGE_TYP: 3.3; FMEDA__FUNCTION_IN_SYSTEM: *
C20 C22-C25 = 100nF / 50V / 10% / SMD 0603: Capacitor, Ceramic Chip, 100nF (0.1uF), 50V, 5%, SMD 0603 [LCA016]; Value: 100n; FMEDA__OPERATING__VOLTAGE_MIN: 0; FMEDA__OPERATING__VOLTAGE_MAX: 3.3; FMEDA__OPERATING__TEMP_MIN: -20; FMEDA__OPERATING__TEMP_TYP: 27; FMEDA__OPERATING__TEMP_MAX: 50; FMEDA__CHANNEL: COM; FMEDA__FUNCTION_IN_SYSTEM: *; FMEDA__OPERATING__VOLTAGE_TYP: 3.3
CN3-CN6 = 7461383: Terminal, Bush with M5 Shank; FMEDA__CHANNEL: COM; FMEDA__OPERATING__CURRENT_MAX: 0; FMEDA__OPERATING__TEMP_MAX: 50; FMEDA__OPERATING__TEMP_MIN: -20; FMEDA__OPERATING__TEMP_TYP: 27; FMEDA__OPERATING__VOLTAGE_MAX: 16; FMEDA__OPERATING__VOLTAGE_TYP: 12; FMEDA__OPERATING__CURRENT_MIN: 0; FMEDA__OPERATING__CURRENT_TYP: 0; FMEDA__OPERATING__VOLTAGE_MIN: 0
D1 = 1N4004: Diode, General Purpose Rectifier, 1A, PTH [LIC010]; FMEDA__OPERATING__TEMP_MAX: 50; FMEDA__OPERATING__TEMP_MIN: -20; FMEDA__OPERATING__TEMP_TYP: 27; FMEDA__OPERATING__VOLTAGE_MAX: 0; FMEDA__CHANNEL: COM; FMEDA__FUNCTION_IN_SYSTEM: *; FMEDA__OPERATING__VOLTAGE_MIN: 0; FMEDA__OPERATING__VOLTAGE_TYP: 0; FMEDA__OPERATING__CURRENT_MAX: 0; FMEDA__OPERATING__CURRENT_MIN: 0; FMEDA__OPERATING__CURRENT_TYP: 0
D2 = BAS16: Diode, Small Signal, 0.2A, 85V, SMD SOT-23 [LIC006]; FMEDA__OPERATING__CURRENT_MIN: 0; FMEDA__OPERATING__TEMP_MIN: -20; FMEDA__OPERATING__TEMP_TYP: 27; FMEDA__OPERATING__TEMP_MAX: 50; FMEDA__CHANNEL: COM; FMEDA__OPERATING__CURRENT_MAX: 0; FMEDA__OPERATING__VOLTAGE_MIN: 0; FMEDA__OPERATING__VOLTAGE_MAX: 0; FMEDA__FUNCTION_IN_SYSTEM: *; FMEDA__OPERATING__CURRENT_TYP: 0; FMEDA__OPERATING__VOLTAGE_TYP: 0
IC4 = EL-17-21VGC/TR8: LED, SMD, 0805 Green [LIC016]; FMEDA__OPERATING__TEMP_MAX: 50; FMEDA__OPERATING__TEMP_MIN: -20; FMEDA__OPERATING__TEMP_TYP: 27; FMEDA__CHANNEL: COM; FMEDA__FUNCTION_IN_SYSTEM: *
IC5 = ACS759LCB-050B-PFF-T: IC, Hall Effect Current Sensor, PTH; FMEDA__OPERATING__TEMP_MAX: 50; FMEDA__OPERATING__TEMP_MIN: -20; FMEDA__OPERATING__TEMP_TYP: 27; FMEDA__CHANNEL: COM; FMEDA__FUNCTION_IN_SYSTEM: *
IC6 = NUD3124LT1G: IC, Relay Driver, 28V Industrial, SMD SOT23 [LIC292]; FMEDA__OPERATING__TEMP_MIN: -20; FMEDA__OPERATING__TEMP_TYP: 27; FMEDA__OPERATING__TEMP_MAX: 50; FMEDA__OPERATING__VOLTAGE_MIN: 0; FMEDA__OPERATING__VOLTAGE_TYP: 13; FMEDA__OPERATING__VOLTAGE_MAX: 18; FMEDA__OPERATING__POWER_TYP: 0.1; FMEDA__OPERATING__POWER_MAX: 0.15; FMEDA__CHANNEL: COM; FMEDA__FUNCTION_IN_SYSTEM: *; FMEDA__OPERATING__POWER_MIN: 0
IC19 IC22 = TL783CKTTR: IC, High Volt LDO, 0.7A [LIC601]; FMEDA__OPERATING__OUTPUT_CURRENT_MIN: 0; FMEDA__OPERATING__TEMP_MAX: 50; FMEDA__OPERATING__TEMP_MIN: -20; FMEDA__OPERATING__TEMP_TYP: 27; VALUE: 0; Note: Obey Thermal Design Rules; FMEDA__CHANNEL: COM; FMEDA__OPERATING__OUTPUT_CURRENT_TYP: 0; FMEDA__OPERATING__VOLTAGE_MAX: 0; FMEDA__OPERATING__VOLTAGE_MIN: 0; FMEDA__OPERATING__VOLTAGE_TYP: 0; FMEDA__FUNCTION_IN_SYSTEM: *
IC20 IC21 = AMC1100DWV: IC, Isolation Amplifier, SMD SOIC8 [LIC549]
R5 = 4.7K / 0.1W / 1% / SMD 0603: as R18 on sheet LPCB234 - 1 WIRE DRIVER; VALUE: 4.7K; FMEDA__OPERATING__POWER_MIN: 0; FMEDA__OPERATING__VOLTAGE_MAX: 0; FMEDA__OPERATING__VOLTAGE_MIN: 0; FMEDA__OPERATING__VOLTAGE_TYP: 0; FMEDA__FUNCTION_IN_SYSTEM: *
R6 = 47R / 0.1W / 1% / SMD 0603: Resistor, Ceramic Chip, 47R, 0.1W, 1%, SMD 0603 [LRE037]; VALUE: 47; FMEDA__OPERATING__POWER_MAX: 0; FMEDA__OPERATING__TEMP_MAX: 50; FMEDA__OPERATING__TEMP_MIN: -20; FMEDA__OPERATING__TEMP_TYP: 27; FMEDA__CHANNEL: COM; FMEDA__OPERATING__POWER_MIN: 0; FMEDA__OPERATING__VOLTAGE_MAX: 0; FMEDA__OPERATING__VOLTAGE_MIN: 0; FMEDA__OPERATING__VOLTAGE_TYP: 0; FMEDA__FUNCTION_IN_SYSTEM: *
R23 R29 = 300K / 0.5W / 1% / SMD 1206: Resistor, Thick Film, 300K, 0.500W, 200V, 1%, SMD 1206 [LRE194]; FMEDA__OPERATING__POWER_MAX: 0.5; FMEDA__OPERATING__POWER_MIN: 0; FMEDA__OPERATING__VOLTAGE_MAX: 200; FMEDA__OPERATING__TEMP_MAX: 155; FMEDA__OPERATING__TEMP_MIN: -55; FMEDA__OPERATING__TEMP_TYP: 27; FMEDA__CHANNEL: COM; VALUE: 300K; FMEDA__OPERATING__VOLTAGE_MIN: 0; FMEDA__OPERATING__VOLTAGE_TYP: 200; FMEDA__FUNCTION_IN_SYSTEM: *
R24 R30 = 82R0 / 0.25W / 1% / SMD 0805: Resistor, Ceramic Chip, 82R, 0.063W, 1%, SMD 0805 [LRE123]; Value: 82; FMEDA__OPERATING__POWER_MAX: 0; FMEDA__OPERATING__TEMP_MAX: 50; FMEDA__OPERATING__TEMP_MIN: -20; FMEDA__OPERATING__TEMP_TYP: 27; FMEDA__CHANNEL: COM; FMEDA__OPERATING__POWER_MIN: 0; FMEDA__OPERATING__VOLTAGE_MAX: 0; FMEDA__OPERATING__VOLTAGE_MIN: 0; FMEDA__OPERATING__VOLTAGE_TYP: 0
R26 R31 = 1K0 / 0.063W / 1% / SMD 0603: Resistor, Ceramic Chip, 1K0, 0.063W, 1%, SMD 0603 [LRE106]; Value: 1K; FMEDA__OPERATING__POWER_MAX: 0; FMEDA__OPERATING__TEMP_MAX: 50; FMEDA__OPERATING__TEMP_MIN: -20; FMEDA__OPERATING__TEMP_TYP: 27; FMEDA__CHANNEL: COM; FMEDA__OPERATING__POWER_MIN: 0; FMEDA__OPERATING__VOLTAGE_MAX: 0; FMEDA__OPERATING__VOLTAGE_MIN: 0; FMEDA__OPERATING__VOLTAGE_TYP: 0; FMEDA__FUNCTION_IN_SYSTEM: *
R27 R32 = 220R / 0.25W / 1% / SMD 0805: Resistor, Ceramic Chip, 220R, 0.25W, 1%, SMD 0805 [LRE013]; Value: 220; FMEDA__OPERATING__POWER_MAX: 0; FMEDA__OPERATING__TEMP_MAX: 50; FMEDA__OPERATING__TEMP_MIN: -20; FMEDA__OPERATING__TEMP_TYP: 27; FMEDA__CHANNEL: COM; FMEDA__OPERATING__POWER_MIN: 0; FMEDA__OPERATING__VOLTAGE_MAX: 0; FMEDA__OPERATING__VOLTAGE_MIN: 0; FMEDA__OPERATING__VOLTAGE_TYP: 0; FMEDA__FUNCTION_IN_SYSTEM: *
R28 R33 = 1K / 0.75W / 5% / 400V / SMD 2010: Resistor, Thick Film, 1K, 0.75W, 5%, 400V, SMD 2010 [LRE133]; FMEDA__OPERATING__POWER_MAX: 0; FMEDA__OPERATING__TEMP_MAX: 50; FMEDA__OPERATING__TEMP_MIN: -20; FMEDA__OPERATING__TEMP_TYP: 27; FMEDA__CHANNEL: COM; Value: 1K; FMEDA__OPERATING__POWER_MIN: 0; FMEDA__OPERATING__VOLTAGE_MAX: 0; FMEDA__OPERATING__VOLTAGE_MIN: 0; FMEDA__OPERATING__VOLTAGE_TYP: 0; FMEDA__FUNCTION_IN_SYSTEM: *
RLY1 = K10P-11D15-24: Relay, DPDT, 24V, Socket Mount; FMEDA__OPERATING__TEMP_MAX: 50; FMEDA__OPERATING__TEMP_MIN: -20; FMEDA__OPERATING__TEMP_TYP: 27; FMEDA__CHANNEL: COM; Revision: July-2002: Re-released for DXP Platform.; FMEDA__FUNCTION_IN_SYSTEM: *
RLY2 = TQ2-24: Relay, DPDT, Non Latching, 24VDC Coil, 1A Rating, PTH; FMEDA__CHANNEL: COM; FMEDA__OPERATING__TEMP_MAX: 50; FMEDA__OPERATING__TEMP_MIN: -20; FMEDA__OPERATING__TEMP_TYP: 27; Revision: July-2002: Re-released for DXP Platform.

## Sheet LPCB234 - POWER INPUT.SchDoc
size A3; Address1: Factory 10; Address2: 9-13 Dingley Avenue, Dandeong, VICTORIA 3175, AUSTRALIA; DocumentNumber: 9; Revision: 1; SheetNumber: 9; SheetTotal: 10; Lockie__PCB_SUB_ASSEMBLY: Power Input System; Lockie__PCB_ASSEMBLY: Main; Lockie__LDL: LPCB234; Lockie__PCB_DESCRIPTION: RM4 Power Node
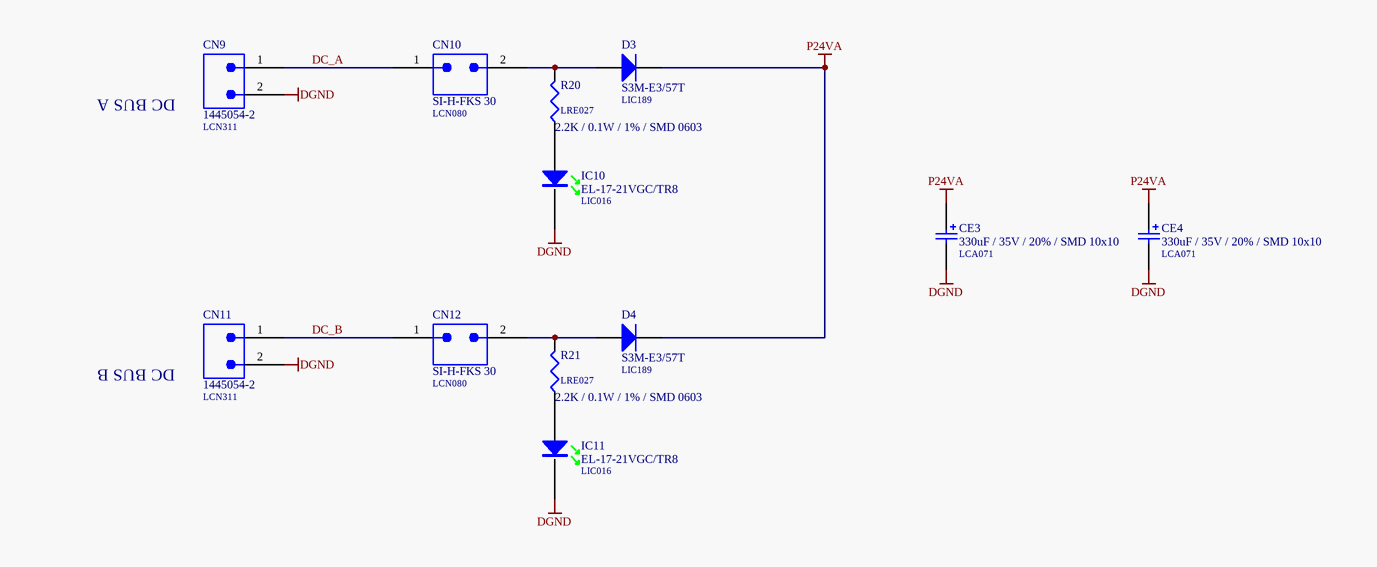
[diagram p6: LPCB234 - POWER INPUT.SchDoc]

### Parts
CE3  330uF / 35V / 20% / SMD 10x10  LDL_NUMBER: LCA071  [LFP041__NICHICON_WT_10X10]
CE4  330uF / 35V / 20% / SMD 10x10  LDL_NUMBER: LCA071  [LFP041__NICHICON_WT_10X10]
CN9  1445054-2  LDL_NUMBER: LCN311  [1445054-2]
CN10  SI-H-FKS 30  LDL_NUMBER: LCN080  [SI-H-FKS-30]
CN11  1445054-2  LDL_NUMBER: LCN311  [1445054-2]
CN12  SI-H-FKS 30  LDL_NUMBER: LCN080  [SI-H-FKS-30]
D3  S3M-E3/57T  LDL_NUMBER: LIC189  [LFP040__DO-214AB]
D4  S3M-E3/57T  LDL_NUMBER: LIC189  [LFP040__DO-214AB]
IC10  EL-17-21VGC/TR8  LDL_NUMBER: LIC016  [CR2012-0805-LED]
IC11  EL-17-21VGC/TR8  LDL_NUMBER: LIC016  [CR2012-0805-LED]
R20  2.2K / 0.1W / 1% / SMD 0603  LDL_NUMBER: LRE027  [LFP020__CR1608-0603-IPC7351_B]
R21  2.2K / 0.1W / 1% / SMD 0603  LDL_NUMBER: LRE027  [LFP020__CR1608-0603-IPC7351_B]

### Nets
DGND: CE3.2 CE4.2 CN9.2 CN11.2 IC10.K IC11.K
P24VA: CE3.1 CE4.1 D3.1(K) D4.1(K)
DC_A: CN9.1 CN10.1
DC_B: CN11.1 CN12.1
NetCN10_2: CN10.2 D3.2(A) R20.2
NetCN12_2: CN12.2 D4.2(A) R21.2
NetIC10_A: IC10.A R20.1
NetIC11_A: IC11.A R21.1

### Notes on the sheet
- DC BUS A
- DC BUS B
- PCB COMPONENT DESCRIPTION
- LDL NUMBER
- Assembly Details
- Size
- Drawing File Name
- Revision
- http://rloop.org
- Scale
- A3
- Sheet Details
- N.T.S
- Sheet:
- Of:

### Library data of the parts
CE3 CE4 = 330uF / 35V / 20% / SMD 10x10: Capacitor, Aluminum Electrolytic, 330uF, 35V, 20%, SMD (10mm x 10mm) [LCA071]; FMEDA__OPERATING__TEMP_MAX: 50; FMEDA__OPERATING__TEMP_MIN: -20; FMEDA__OPERATING__TEMP_TYP: 27; FMEDA__OPERATING__VOLTAGE_MAX: 0; Value: 330u; FMEDA__CHANNEL: COM; FMEDA__OPERATING__VOLTAGE_MIN: 0; FMEDA__OPERATING__VOLTAGE_TYP: 0; FMEDA__FUNCTION_IN_SYSTEM: *
CN9 CN11 = 1445054-2: Connector, MATE-N-LOK, Header, 2 Way, PTH; FMEDA__CHANNEL: COM; FMEDA__OPERATING__CURRENT_MAX: 0; FMEDA__OPERATING__TEMP_MAX: 50; FMEDA__OPERATING__TEMP_MIN: -20; FMEDA__OPERATING__TEMP_TYP: 27; FMEDA__OPERATING__VOLTAGE_MAX: 16; FMEDA__OPERATING__VOLTAGE_TYP: 12; FMEDA__OPERATING__CURRENT_MIN: 0; FMEDA__OPERATING__CURRENT_TYP: 0; FMEDA__OPERATING__VOLTAGE_MIN: 0; FMEDA__FUNCTION_IN_SYSTEM: *
CN10 CN12 = SI-H-FKS 30: Connector, Blade Fuse Holder, 5mm Terminals, 30A Max, PTH; FMEDA__CHANNEL: COM; FMEDA__OPERATING__CURRENT_MAX: 0; FMEDA__OPERATING__TEMP_MAX: 50; FMEDA__OPERATING__TEMP_MIN: -20; FMEDA__OPERATING__TEMP_TYP: 27; FMEDA__OPERATING__VOLTAGE_MAX: 16; FMEDA__OPERATING__VOLTAGE_TYP: 12; FMEDA__FUNCTION_IN_SYSTEM: *; FMEDA__OPERATING__CURRENT_MIN: 0; FMEDA__OPERATING__CURRENT_TYP: 0; FMEDA__OPERATING__VOLTAGE_MIN: 0
D3 D4 = S3M-E3/57T: Diode, General Purpose Rectifier, 3A, 200V, SMD DO-214AB [LIC189]; FMEDA__OPERATING__CURRENT_MAX: 0; FMEDA__OPERATING__TEMP_MAX: 50; FMEDA__OPERATING__TEMP_MIN: -20; FMEDA__OPERATING__TEMP_TYP: 27; FMEDA__CHANNEL: COM; FMEDA__OPERATING__CURRENT_MIN: 0; FMEDA__OPERATING__CURRENT_TYP: 0; FMEDA__OPERATING__VOLTAGE_MAX: 0; FMEDA__OPERATING__VOLTAGE_MIN: 0; FMEDA__OPERATING__VOLTAGE_TYP: 0; FMEDA__FUNCTION_IN_SYSTEM: *
IC10 IC11 = EL-17-21VGC/TR8: as IC4 on sheet LPCB234 - CHARGER IF; FMEDA__FUNCTION_IN_SYSTEM: *
R20 R21 = 2.2K / 0.1W / 1% / SMD 0603: Resistor, Ceramic Chip, 2.2K, 0.1W, 1%, SMD 0603 [LRE027]; FMEDA__OPERATING__VOLTAGE_MIN: 0; FMEDA__OPERATING__TEMP_MIN: -20; FMEDA__OPERATING__TEMP_TYP: 27; FMEDA__OPERATING__TEMP_MAX: 50; FMEDA__CHANNEL: COM; VALUE: 2.2K; FMEDA__OPERATING__VOLTAGE_MAX: 0; FMEDA__OPERATING__POWER_MIN: 0; FMEDA__OPERATING__POWER_MAX: 0; FMEDA__FUNCTION_IN_SYSTEM: *; FMEDA__OPERATING__VOLTAGE_TYP: 0

## Sheet LPCB234 - PSU.SchDoc
size A3; Address1: Factory 10; Address2: 9-13 Dingley Avenue, Dandeong, VICTORIA 3175, AUSTRALIA; DocumentNumber: 10; Revision: 1; SheetNumber: 10; SheetTotal: 10; Lockie__PCB_SUB_ASSEMBLY: Local Power Supplies; Lockie__PCB_ASSEMBLY: Main; Lockie__LDL: LPCB234; Lockie__PCB_DESCRIPTION: RM4 Power Node
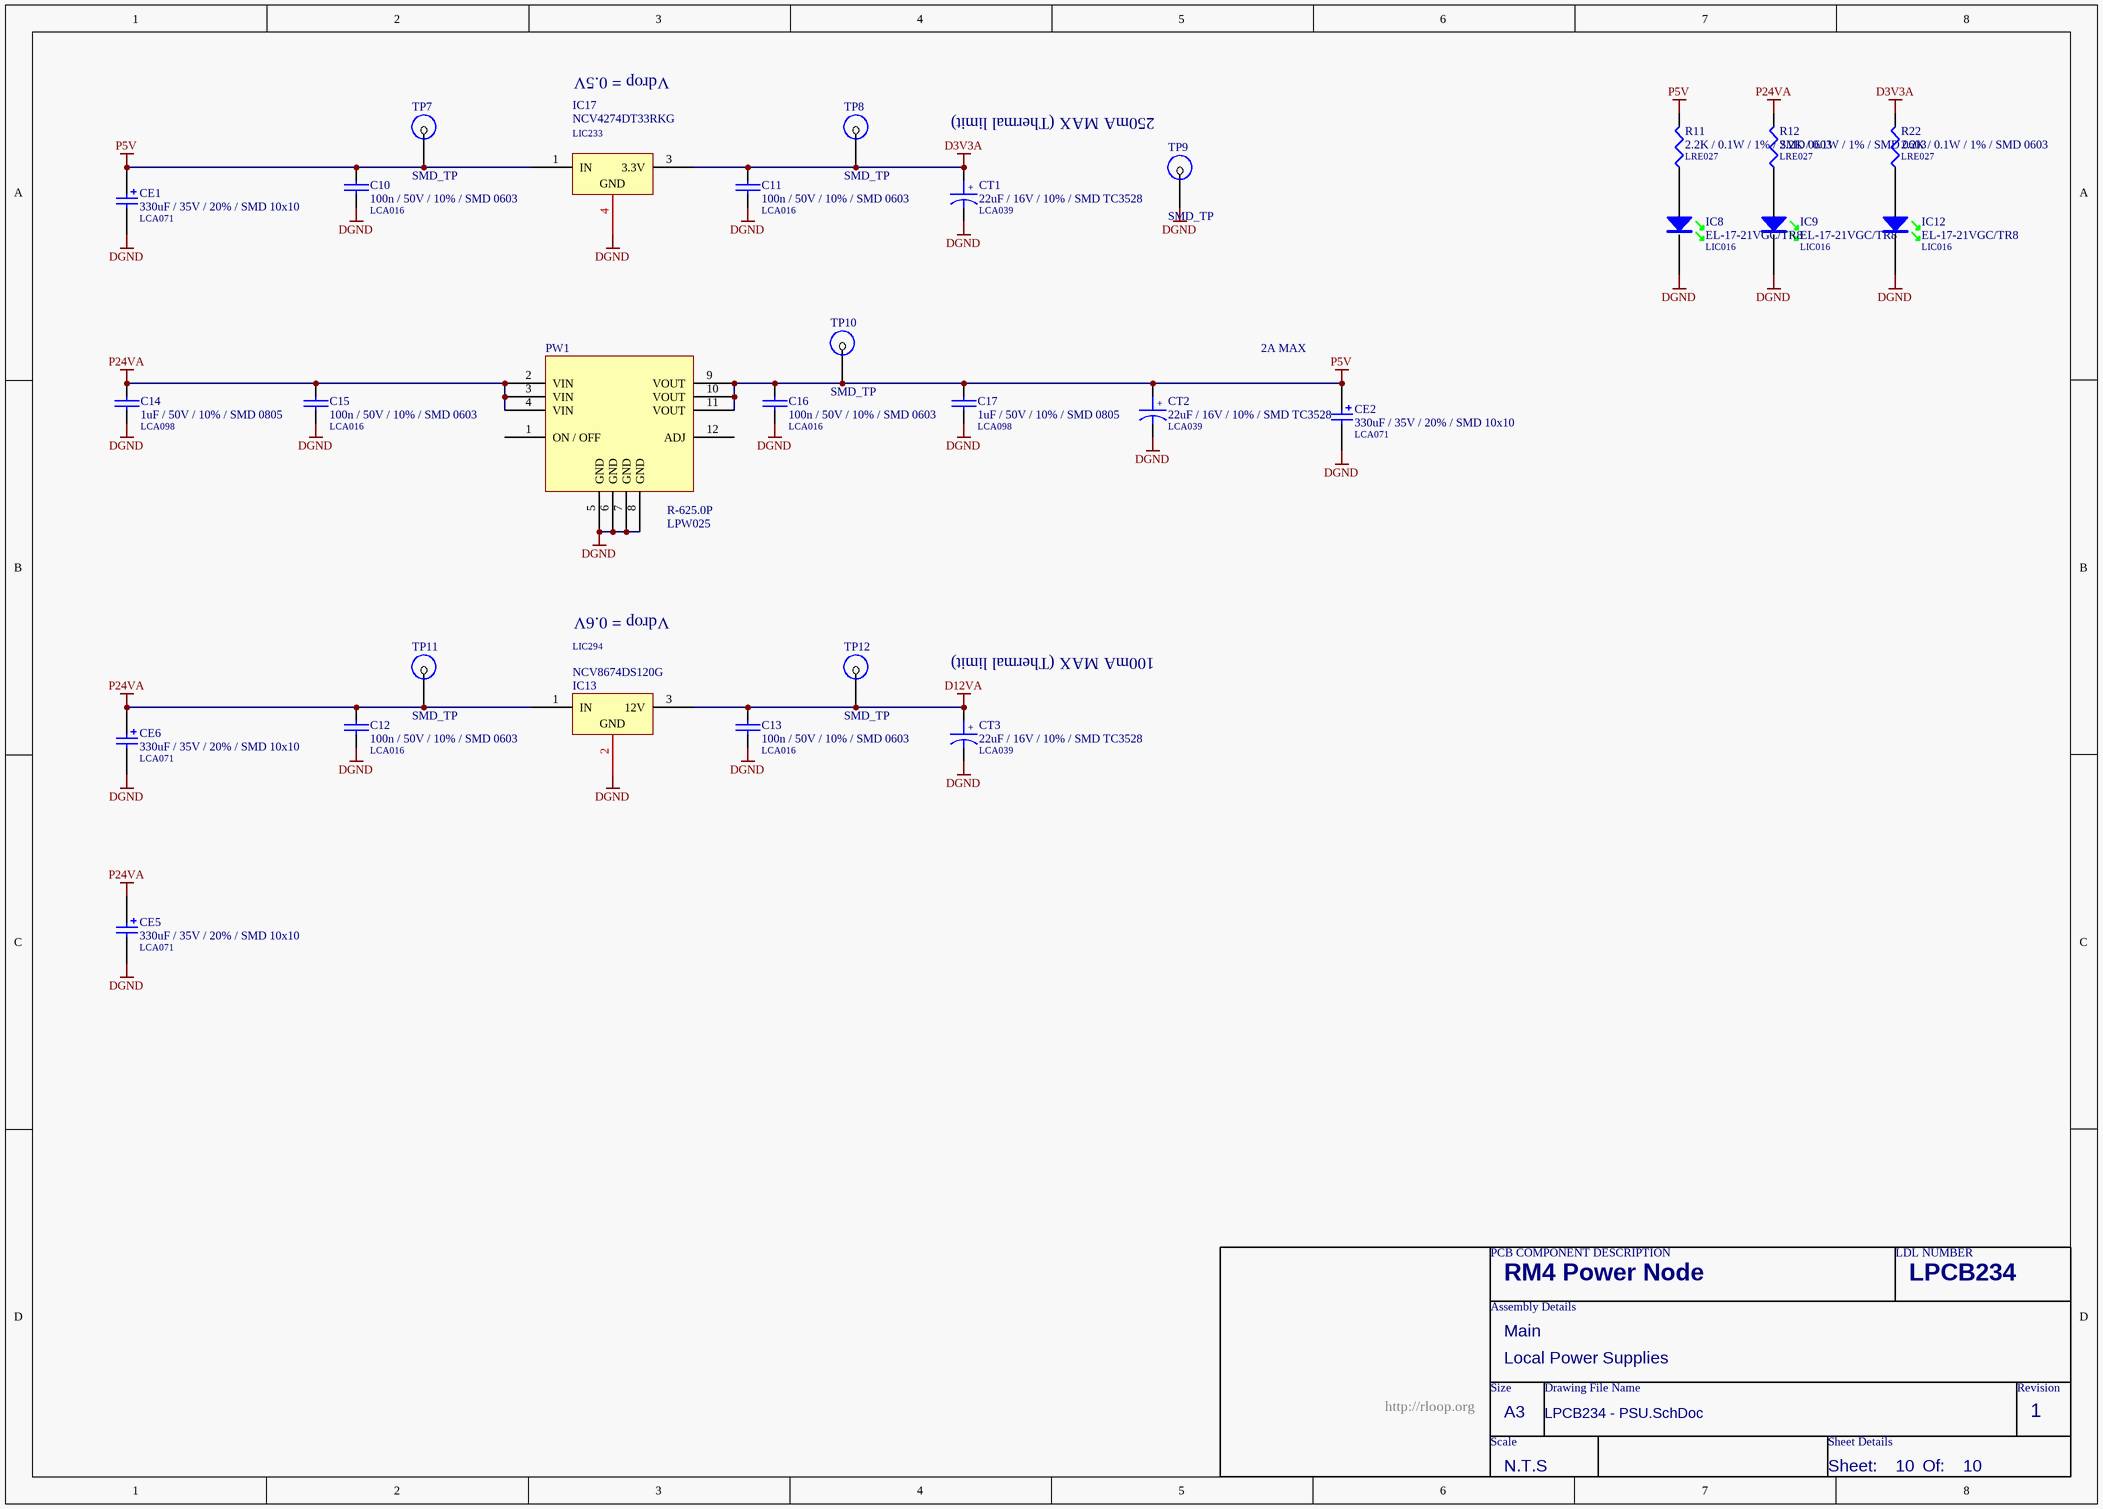
[diagram p7: LPCB234 - PSU.SchDoc]

### Parts
C10  100n / 50V / 10% / SMD 0603  LDL_NUMBER: LCA016  [LFP011__CC1608-0603-IPC7351_B]
C11  100n / 50V / 10% / SMD 0603  LDL_NUMBER: LCA016  [LFP011__CC1608-0603-IPC7351_B]
C12  100n / 50V / 10% / SMD 0603  LDL_NUMBER: LCA016  [LFP011__CC1608-0603-IPC7351_B]
C13  100n / 50V / 10% / SMD 0603  LDL_NUMBER: LCA016  [LFP011__CC1608-0603-IPC7351_B]
C14  1uF / 50V / 10% / SMD 0805  LDL_NUMBER: LCA098  [LFP010__CC2012-0805-IPC7351_B]
C15  100n / 50V / 10% / SMD 0603  LDL_NUMBER: LCA016  [LFP011__CC1608-0603-IPC7351_B]
C16  100n / 50V / 10% / SMD 0603  LDL_NUMBER: LCA016  [LFP011__CC1608-0603-IPC7351_B]
C17  1uF / 50V / 10% / SMD 0805  LDL_NUMBER: LCA098  [LFP010__CC2012-0805-IPC7351_B]
CE1  330uF / 35V / 20% / SMD 10x10  LDL_NUMBER: LCA071  [LFP041__NICHICON_WT_10X10]
CE2  330uF / 35V / 20% / SMD 10x10  LDL_NUMBER: LCA071  [LFP041__NICHICON_WT_10X10]
CE5  330uF / 35V / 20% / SMD 10x10  LDL_NUMBER: LCA071  [LFP041__NICHICON_WT_10X10]
CE6  330uF / 35V / 20% / SMD 10x10  LDL_NUMBER: LCA071  [LFP041__NICHICON_WT_10X10]
CT1  22uF / 16V / 10% / SMD TC3528  LDL_NUMBER: LCA039  [LFP018__TC3528]
CT2  22uF / 16V / 10% / SMD TC3528  LDL_NUMBER: LCA039  [LFP018__TC3528]
CT3  22uF / 16V / 10% / SMD TC3528  LDL_NUMBER: LCA039  [LFP018__TC3528]
IC8  EL-17-21VGC/TR8  LDL_NUMBER: LIC016  [CR2012-0805-LED]
IC9  EL-17-21VGC/TR8  LDL_NUMBER: LIC016  [CR2012-0805-LED]
IC12  EL-17-21VGC/TR8  LDL_NUMBER: LIC016  [CR2012-0805-LED]
IC13  NCV8674DS120G  LDL_NUMBER: LIC294  [LFP082__D2PAK]
IC17  NCV4274DT33RKG  LDL_NUMBER: LIC233  [LFP019__369A-13]
PW1  R-625.0P  LDL_NUMBER: LPW025  [R-625.0P]
R11  2.2K / 0.1W / 1% / SMD 0603  LDL_NUMBER: LRE027  [LFP020__CR1608-0603-IPC7351_B]
R12  2.2K / 0.1W / 1% / SMD 0603  LDL_NUMBER: LRE027  [LFP020__CR1608-0603-IPC7351_B]
R22  2.2K / 0.1W / 1% / SMD 0603  LDL_NUMBER: LRE027  [LFP020__CR1608-0603-IPC7351_B]
TP7  SMD_TP  [SMD-TP]  (no BOM)
TP8  SMD_TP  [SMD-TP]  (no BOM)
TP9  SMD_TP  [SMD-TP]  (no BOM)
TP10  SMD_TP  [SMD-TP]  (no BOM)
TP11  SMD_TP  [SMD-TP]  (no BOM)
TP12  SMD_TP  [SMD-TP]  (no BOM)

### Nets
D3V3A: C11.1 CT1.1 IC17.3(3.3V) R22.2 TP8.1
D12VA: C13.1 CT3.1 IC13.3(12V) TP12.1
DGND: C10.2 C11.2 C12.2 C13.2 C14.2 C15.2 C16.2 C17.2 CE1.2 CE2.2 CE5.2 CE6.2 CT1.2 CT2.2 CT3.2 IC8.K IC9.K IC12.K IC13.2(GND) IC17.4(GND) PW1.5(GND) PW1.6(GND) PW1.7(GND) PW1.8(GND) TP9.1
P5V: C10.1 C16.1 C17.1 CE1.1 CE2.1 CT2.1 IC17.1(IN) PW1.9(VOUT) PW1.10(VOUT) PW1.11(VOUT) R11.2 TP7.1 TP10.1
P24VA: C12.1 C14.1 C15.1 CE5.1 CE6.1 IC13.1(IN) PW1.2(VIN) PW1.3(VIN) PW1.4(VIN) R12.2 TP11.1
NetIC8_A: IC8.A R11.1
NetIC9_A: IC9.A R12.1
NetIC12_A: IC12.A R22.1

Not connected (* = marked no-connect by the designer): PW1 1(ON_/_OFF) 12(ADJ)

### Notes on the sheet
- Vdrop = 0.5V
- 250mA MAX (Thermal limit)
- 2A MAX
- Vdrop = 0.6V
- (near CT3) 100mA MAX (Thermal limit)
- PCB COMPONENT DESCRIPTION
- LDL NUMBER
- Assembly Details
- Size
- Drawing File Name
- Revision
- http://rloop.org
- Scale
- A3
- Sheet Details
- N.T.S
- Sheet:
- Of:
- (in symbol 22uF / 16V / 10% / SMD TC3528) +

### Library data of the parts
C10-C13 C15 C16 = 100n / 50V / 10% / SMD 0603: as C1 on sheet LPCB234 - 1 WIRE DRIVER; Value: 100n; FMEDA__FUNCTION_IN_SYSTEM: *; FMEDA__OPERATING__VOLTAGE_TYP: 3.3
C14 C17 = 1uF / 50V / 10% / SMD 0805: Capacitor, Ceramic Chip, 1uF, 50V, SMD 0805 [LCA098]; Value: 1u; FMEDA__OPERATING__VOLTAGE_MAX: 3.3; FMEDA__OPERATING__VOLTAGE_MIN: 0; FMEDA__OPERATING__TEMP_MAX: 50; FMEDA__OPERATING__TEMP_MIN: -20; FMEDA__OPERATING__TEMP_TYP: 27; FMEDA__CHANNEL: COM; FMEDA__OPERATING__VOLTAGE_TYP: 3.3; FMEDA__FUNCTION_IN_SYSTEM: *
CE1 CE2 CE5 CE6 = 330uF / 35V / 20% / SMD 10x10: as CE3 on sheet LPCB234 - POWER INPUT; FMEDA__OPERATING__VOLTAGE_MIN: 0; FMEDA__OPERATING__VOLTAGE_TYP: 0; FMEDA__FUNCTION_IN_SYSTEM: *
CT1-CT3 = 22uF / 16V / 10% / SMD TC3528: Capacitor, Tantalum, 22uF, 16V, 10%, SMD TC3528 (BCASE) [LCA039]; Value: 22u; FMEDA__OPERATING__VOLTAGE_MAX: 3.3; FMEDA__OPERATING__VOLTAGE_MIN: 0; FMEDA__OPERATING__TEMP_MAX: 50; FMEDA__OPERATING__TEMP_MIN: -20; FMEDA__OPERATING__TEMP_TYP: 27; FMEDA__CHANNEL: COM; FMEDA__OPERATING__VOLTAGE_TYP: 3.3; FMEDA__FUNCTION_IN_SYSTEM: *
IC8 IC9 IC12 = EL-17-21VGC/TR8: as IC4 on sheet LPCB234 - CHARGER IF; FMEDA__FUNCTION_IN_SYSTEM: *
IC13 = NCV8674DS120G: IC, Voltage Regulator, 0.35A, 12V, SMD D2PAK [LIC294]; FMEDA__OPERATING__OUTPUT_CURRENT_MIN: 0; FMEDA__OPERATING__TEMP_MAX: 50; FMEDA__OPERATING__TEMP_MIN: -20; FMEDA__OPERATING__TEMP_TYP: 27; VALUE: 0; Note: Obey Thermal Design Rules; FMEDA__CHANNEL: COM; FMEDA__OPERATING__OUTPUT_CURRENT_TYP: 0; FMEDA__OPERATING__VOLTAGE_MAX: 0; FMEDA__OPERATING__VOLTAGE_MIN: 0; FMEDA__OPERATING__VOLTAGE_TYP: 0; FMEDA__FUNCTION_IN_SYSTEM: *
IC17 = NCV4274DT33RKG: IC, Voltage Regulator, 400mA, 3.3V LDO, SMD DPAK [LIC233]; FMEDA__OPERATING__OUTPUT_CURRENT_MIN: 0; FMEDA__OPERATING__TEMP_MAX: 50; FMEDA__OPERATING__TEMP_MIN: -20; FMEDA__OPERATING__TEMP_TYP: 27; VALUE: 0; Note: Obey Thermal Design Rules; FMEDA__CHANNEL: COM; FMEDA__OPERATING__OUTPUT_CURRENT_TYP: 0; FMEDA__OPERATING__VOLTAGE_MAX: 0; FMEDA__OPERATING__VOLTAGE_MIN: 0; FMEDA__OPERATING__VOLTAGE_TYP: 0; FMEDA__FUNCTION_IN_SYSTEM: *
PW1 = R-625.0P: Non Isolated DC/DC Module
R11 R12 R22 = 2.2K / 0.1W / 1% / SMD 0603: as R20 on sheet LPCB234 - POWER INPUT; VALUE: 2.2K; FMEDA__OPERATING__VOLTAGE_MAX: 0; FMEDA__OPERATING__POWER_MIN: 0; FMEDA__OPERATING__POWER_MAX: 0; FMEDA__FUNCTION_IN_SYSTEM: *; FMEDA__OPERATING__VOLTAGE_TYP: 0
TP7-TP12 = SMD_TP: as TP1 on sheet LPCB234 - BMS INTERFACE; FMEDA__OPERATING__CURRENT_MIN: 0; FMEDA__OPERATING__CURRENT_TYP: 0; FMEDA__OPERATING__VOLTAGE_MIN: 0

## Sheet LPCB234 - CAN.SchDoc
size A3; Address1: Factory 10; Address2: 9-13 Dingley Avenue, Dandeong, VICTORIA 3175, AUSTRALIA; DocumentNumber: 5; Revision: 1; SheetNumber: 5; SheetTotal: 10; Lockie__PCB_SUB_ASSEMBLY: CAN Interface; Lockie__PCB_ASSEMBLY: Main; Lockie__LDL: LPCB234; Lockie__PCB_DESCRIPTION: RM4 Power Node
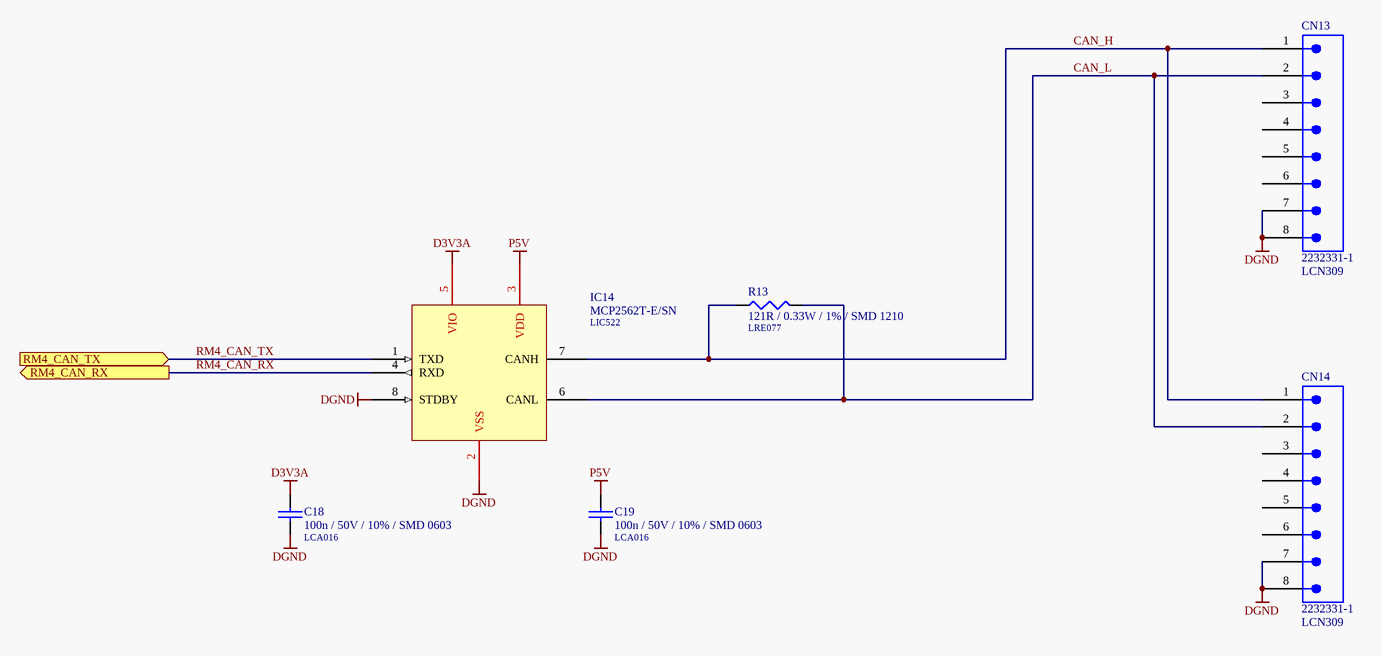
[diagram p8: LPCB234 - CAN.SchDoc]

### Parts
C18  100n / 50V / 10% / SMD 0603  LDL_NUMBER: LCA016  [LFP011__CC1608-0603-IPC7351_B]
C19  100n / 50V / 10% / SMD 0603  LDL_NUMBER: LCA016  [LFP011__CC1608-0603-IPC7351_B]
CN13  2232331-1  LDL_NUMBER: LCN309  [2232331-1]
CN14  2232331-1  LDL_NUMBER: LCN309  [2232331-1]
IC14  MCP2562T-E/SN  LDL_NUMBER: LIC522  [LFP017__SO-G8/Y1.9]
R13  121R / 0.33W / 1% / SMD 1210  LDL_NUMBER: LRE077  [LFP028__CR3225-1210]

### Ports
RM4_CAN_RX (out), RM4_CAN_TX (in)

### Nets
D3V3A: C18.1 IC14.5(VIO)
DGND: C18.2 C19.2 CN13.7 CN13.8 CN14.7 CN14.8 IC14.2(VSS) IC14.8(STDBY)
P5V: C19.1 IC14.3(VDD)
CAN_H: CN13.1 CN14.1 IC14.7(CANH) R13.1
CAN_L: CN13.2 CN14.2 IC14.6(CANL) R13.2
RM4_CAN_RX: IC14.4(RXD) ; port RM4_CAN_RX
RM4_CAN_TX: IC14.1(TXD) ; port RM4_CAN_TX

Not connected (* = marked no-connect by the designer): CN13 3 4 5 6; CN14 3 4 5 6

### Notes on the sheet
- PCB COMPONENT DESCRIPTION
- LDL NUMBER
- Assembly Details
- Size
- Drawing File Name
- Revision
- http://rloop.org
- Scale
- A3
- Sheet Details
- N.T.S
- Sheet:
- Of:

### Library data of the parts
C18 C19 = 100n / 50V / 10% / SMD 0603: as C1 on sheet LPCB234 - 1 WIRE DRIVER; Value: 100n; FMEDA__FUNCTION_IN_SYSTEM: *; FMEDA__OPERATING__VOLTAGE_TYP: 3.3
CN13 CN14 = 2232331-1: Connector, M12 8 Way, PCB Mount; FMEDA__CHANNEL: COM; FMEDA__OPERATING__CURRENT_MAX: 0; FMEDA__OPERATING__TEMP_MAX: 50; FMEDA__OPERATING__TEMP_MIN: -20; FMEDA__OPERATING__TEMP_TYP: 27; FMEDA__OPERATING__VOLTAGE_MAX: 16; FMEDA__OPERATING__VOLTAGE_TYP: 12; FMEDA__FUNCTION_IN_SYSTEM: *; FMEDA__OPERATING__CURRENT_MIN: 0; FMEDA__OPERATING__CURRENT_TYP: 0; FMEDA__OPERATING__VOLTAGE_MIN: 0
IC14 = MCP2562T-E/SN: IC, High Speed CAN Transceiver, SMD SOIC8 [LIC522]; FMEDA__OPERATING__TEMP_MAX: 50; FMEDA__OPERATING__TEMP_MIN: -20; FMEDA__OPERATING__TEMP_TYP: 27; FMEDA__OPERATING__VOLTAGE_MAX: 0; FMEDA__CHANNEL: COM; FMEDA__OPERATING__VOLTAGE_MIN: 0; FMEDA__OPERATING__VOLTAGE_TYP: 0; FMEDA__FUNCTION_IN_SYSTEM: *
R13 = 121R / 0.33W / 1% / SMD 1210: Resistor, Ceramic Chip, 121R, 0.33W, 1%, SMD 1210 [LRE077]; VALUE: 121; FMEDA__OPERATING__POWER_MAX: 0; FMEDA__OPERATING__TEMP_MAX: 50; FMEDA__OPERATING__TEMP_MIN: -20; FMEDA__OPERATING__TEMP_TYP: 27; FMEDA__CHANNEL: COM; FMEDA__OPERATING__POWER_MIN: 0; FMEDA__OPERATING__VOLTAGE_MAX: 0; FMEDA__OPERATING__VOLTAGE_MIN: 0; FMEDA__OPERATING__VOLTAGE_TYP: 0; FMEDA__FUNCTION_IN_SYSTEM: *

## Sheet LPCB234 - PI.SchDoc
size A3; Address1: Factory 10; Address2: 9-13 Dingley Avenue, Dandeong, VICTORIA 3175, AUSTRALIA; DocumentNumber: 8; Revision: 1; SheetNumber: 8; SheetTotal: 10; Lockie__PCB_SUB_ASSEMBLY: PI Interface; Lockie__PCB_ASSEMBLY: Main; Lockie__LDL: LPCB234; Lockie__PCB_DESCRIPTION: RM4 Power Node
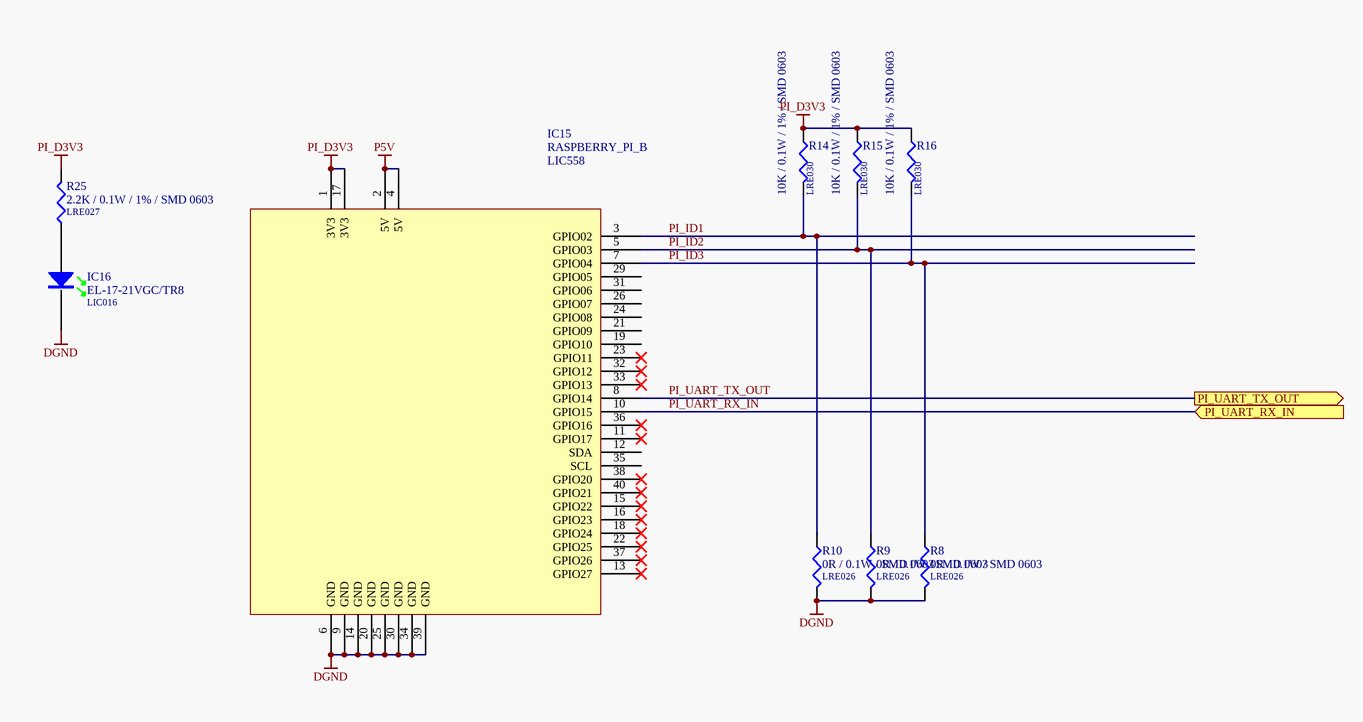
[diagram p9: LPCB234 - PI.SchDoc]

### Parts
IC15  RASPBERRY_PI_B  LDL_NUMBER: LIC558  [RASPBERRY_PI_B_VERT]
IC16  EL-17-21VGC/TR8  LDL_NUMBER: LIC016  [CR2012-0805-LED]
R8  0R / 0.1W / SMD 0603  LDL_NUMBER: LRE026  [LFP020__CR1608-0603-IPC7351_B]
R9  0R / 0.1W / SMD 0603  LDL_NUMBER: LRE026  [LFP020__CR1608-0603-IPC7351_B]
R10  0R / 0.1W / SMD 0603  LDL_NUMBER: LRE026  [LFP020__CR1608-0603-IPC7351_B]
R14  10K / 0.1W / 1% / SMD 0603  LDL_NUMBER: LRE030  [LFP020__CR1608-0603-IPC7351_B]
R15  10K / 0.1W / 1% / SMD 0603  LDL_NUMBER: LRE030  [LFP020__CR1608-0603-IPC7351_B]
R16  10K / 0.1W / 1% / SMD 0603  LDL_NUMBER: LRE030  [LFP020__CR1608-0603-IPC7351_B]
R25  2.2K / 0.1W / 1% / SMD 0603  LDL_NUMBER: LRE027  [LFP020__CR1608-0603-IPC7351_B]

### Ports
PI_UART_RX_IN (in), PI_UART_TX_OUT (out)

### Nets
DGND: IC15.6(GND) IC15.9(GND) IC15.14(GND) IC15.20(GND) IC15.25(GND) IC15.30(GND) IC15.34(GND) IC15.39(GND) IC16.K R8.2 R9.2 R10.2
P5V: IC15.2(5V) IC15.4(5V)
PI_D3V3: IC15.1(3V3) IC15.17(3V3) R14.1 R15.1 R16.1 R25.2
PI_ID1: IC15.3(GPIO02) R10.1 R14.2
PI_ID2: IC15.5(GPIO03) R9.1 R15.2
PI_ID3: IC15.7(GPIO04) R8.1 R16.2
PI_UART_RX_IN: IC15.10(GPIO15) ; port PI_UART_RX_IN
PI_UART_TX_OUT: IC15.8(GPIO14) ; port PI_UART_TX_OUT
NetIC16_A: IC16.A R25.1

Not connected (* = marked no-connect by the designer): IC15 11(GPIO17)* 12(SDA) 13(GPIO27)* 15(GPIO22)* 16(GPIO23)* 18(GPIO24)* 19(GPIO10) 21(GPIO09) 22(GPIO25)* 23(GPIO11)* 24(GPIO08) 26(GPIO07) 29(GPIO05) 31(GPIO06) 32(GPIO12)* 33(GPIO13)* 35(SCL) 36(GPIO16)* 37(GPIO26)* 38(GPIO20)* 40(GPIO21)*

### Notes on the sheet
- PCB COMPONENT DESCRIPTION
- LDL NUMBER
- Assembly Details
- Size
- Drawing File Name
- Revision
- http://rloop.org
- Scale
- A3
- Sheet Details
- N.T.S
- Sheet:
- Of:

### Library data of the parts
IC15 = RASPBERRY_PI_B: Raspberry Pi Model B
IC16 = EL-17-21VGC/TR8: as IC4 on sheet LPCB234 - CHARGER IF; FMEDA__FUNCTION_IN_SYSTEM: *
R8-R10 = 0R / 0.1W / SMD 0603: Resistor, Ceramic Chip, 0R, 0.1W, SMD 0603 [LRE026]; Value: 0; FMEDA__OPERATING__TEMP_MAX: 50; FMEDA__OPERATING__TEMP_MIN: -20; FMEDA__OPERATING__TEMP_TYP: 27; FMEDA__CHANNEL: COM; FMEDA__OPERATING__POWER_MAX: 0; FMEDA__OPERATING__POWER_MIN: 0; FMEDA__OPERATING__VOLTAGE_MAX: 0; FMEDA__OPERATING__VOLTAGE_MIN: 0; FMEDA__OPERATING__VOLTAGE_TYP: 0; FMEDA__FUNCTION_IN_SYSTEM: *
R14-R16 = 10K / 0.1W / 1% / SMD 0603: as R1 on sheet LPCB234 - BMS INTERFACE; Value: 10K; FMEDA__OPERATING__POWER_MIN: 0; FMEDA__OPERATING__VOLTAGE_MAX: 0; FMEDA__OPERATING__VOLTAGE_MIN: 0; FMEDA__OPERATING__VOLTAGE_TYP: 0; FMEDA__FUNCTION_IN_SYSTEM: *
R25 = 2.2K / 0.1W / 1% / SMD 0603: as R20 on sheet LPCB234 - POWER INPUT; VALUE: 2.2K; FMEDA__OPERATING__VOLTAGE_MAX: 0; FMEDA__OPERATING__POWER_MIN: 0; FMEDA__OPERATING__POWER_MAX: 0; FMEDA__FUNCTION_IN_SYSTEM: *; FMEDA__OPERATING__VOLTAGE_TYP: 0

## Nets that join several sheets
D3V3A: LPCB234 - 1 WIRE DRIVER (18 pins), LPCB234 - 24V POWER (CN1.1), LPCB234 - BMS INTERFACE (C6.1 IC3.1 R1.2 R2.2), LPCB234 - CHARGER IF (6 pins), LPCB234 - PSU (5 pins), LPCB234 - CAN (C18.1 IC14.5)
DGND: LPCB234 - CORE INTERFACE (11 pins), LPCB234 - 1 WIRE DRIVER (17 pins), LPCB234 - 24V POWER (CN1.3 CN1.4 CN1.5 CN1.8), LPCB234 - BMS INTERFACE (C6.2 CN2.11 IC3.8), LPCB234 - CHARGER IF (11 pins), LPCB234 - POWER INPUT (6 pins), LPCB234 - PSU (25 pins), LPCB234 - CAN (8 pins), LPCB234 - PI (12 pins)
ONEWIRE_A: LPCB234 - 1 WIRE DRIVER (IC1.2 Q1.3), LPCB234 - 24V POWER (CN1.6)
ONEWIRE_B: LPCB234 - 1 WIRE DRIVER (IC2.2 Q2.3), LPCB234 - 24V POWER (CN1.7)
P5V: LPCB234 - CORE INTERFACE (5 pins), LPCB234 - PSU (13 pins), LPCB234 - CAN (C19.1 IC14.3), LPCB234 - PI (IC15.2 IC15.4)
P24VA: LPCB234 - CHARGER IF (5 pins), LPCB234 - POWER INPUT (CE3.1 CE4.1 D3.1 D4.1), LPCB234 - PSU (11 pins)
BMS_IRQ: LPCB234 - CORE INTERFACE (CN8.42), LPCB234 - BMS INTERFACE (IC3.7 R2.1 TP6.1)
BMS_MISO: LPCB234 - CORE INTERFACE (CN8.88), LPCB234 - BMS INTERFACE (IC3.4 TP3.1)
BMS_MOSI: LPCB234 - CORE INTERFACE (CN8.38), LPCB234 - BMS INTERFACE (IC3.2 TP1.1)
BMS_NCS: LPCB234 - CORE INTERFACE (CN8.81), LPCB234 - BMS INTERFACE (IC3.6 R1.1 TP5.1)
BMS_PWR_AVAIL: LPCB234 - CORE INTERFACE (CN8.33), LPCB234 - BMS INTERFACE (IC3.5 TP4.1)
BMS_SCK: LPCB234 - CORE INTERFACE (CN8.39), LPCB234 - BMS INTERFACE (IC3.3 TP2.1)
CHG_BUS_TIE: LPCB234 - CORE INTERFACE (CN8.32), LPCB234 - CHARGER IF (IC6.1)
CHG_CURRENT: LPCB234 - CORE INTERFACE (CN8.57), LPCB234 - CHARGER IF (C8.1 R6.1)
NetCN1_2: LPCB234 - CORE INTERFACE (CN8.34), LPCB234 - 24V POWER (CN1.2)
NetCN2_13: LPCB234 - CORE INTERFACE (CN8.83), LPCB234 - BMS INTERFACE (CN2.13)
NetCN8_59: LPCB234 - CORE INTERFACE (CN8.59), LPCB234 - CHARGER IF (R26.2)
NetCN8_61: LPCB234 - CORE INTERFACE (CN8.61), LPCB234 - CHARGER IF (R31.2)
PI_UART_RX_IN: LPCB234 - CORE INTERFACE (CN8.93), LPCB234 - PI (IC15.10)
PI_UART_TX_OUT: LPCB234 - CORE INTERFACE (CN8.43), LPCB234 - PI (IC15.8)
RM4_CAN_RX: LPCB234 - CORE INTERFACE (CN8.44), LPCB234 - CAN (IC14.4)
RM4_CAN_TX: LPCB234 - CORE INTERFACE (CN8.94), LPCB234 - CAN (IC14.1)
RM4_I2C_SCL: LPCB234 - CORE INTERFACE (CN8.95), LPCB234 - 1 WIRE DRIVER (5 pins)
RM4_I2C_SDA: LPCB234 - CORE INTERFACE (CN8.45), LPCB234 - 1 WIRE DRIVER (5 pins)